# EAGLE design CARA_brain_v1_2 (EAGLE 7.3.0)

## Sheet 1 of 5
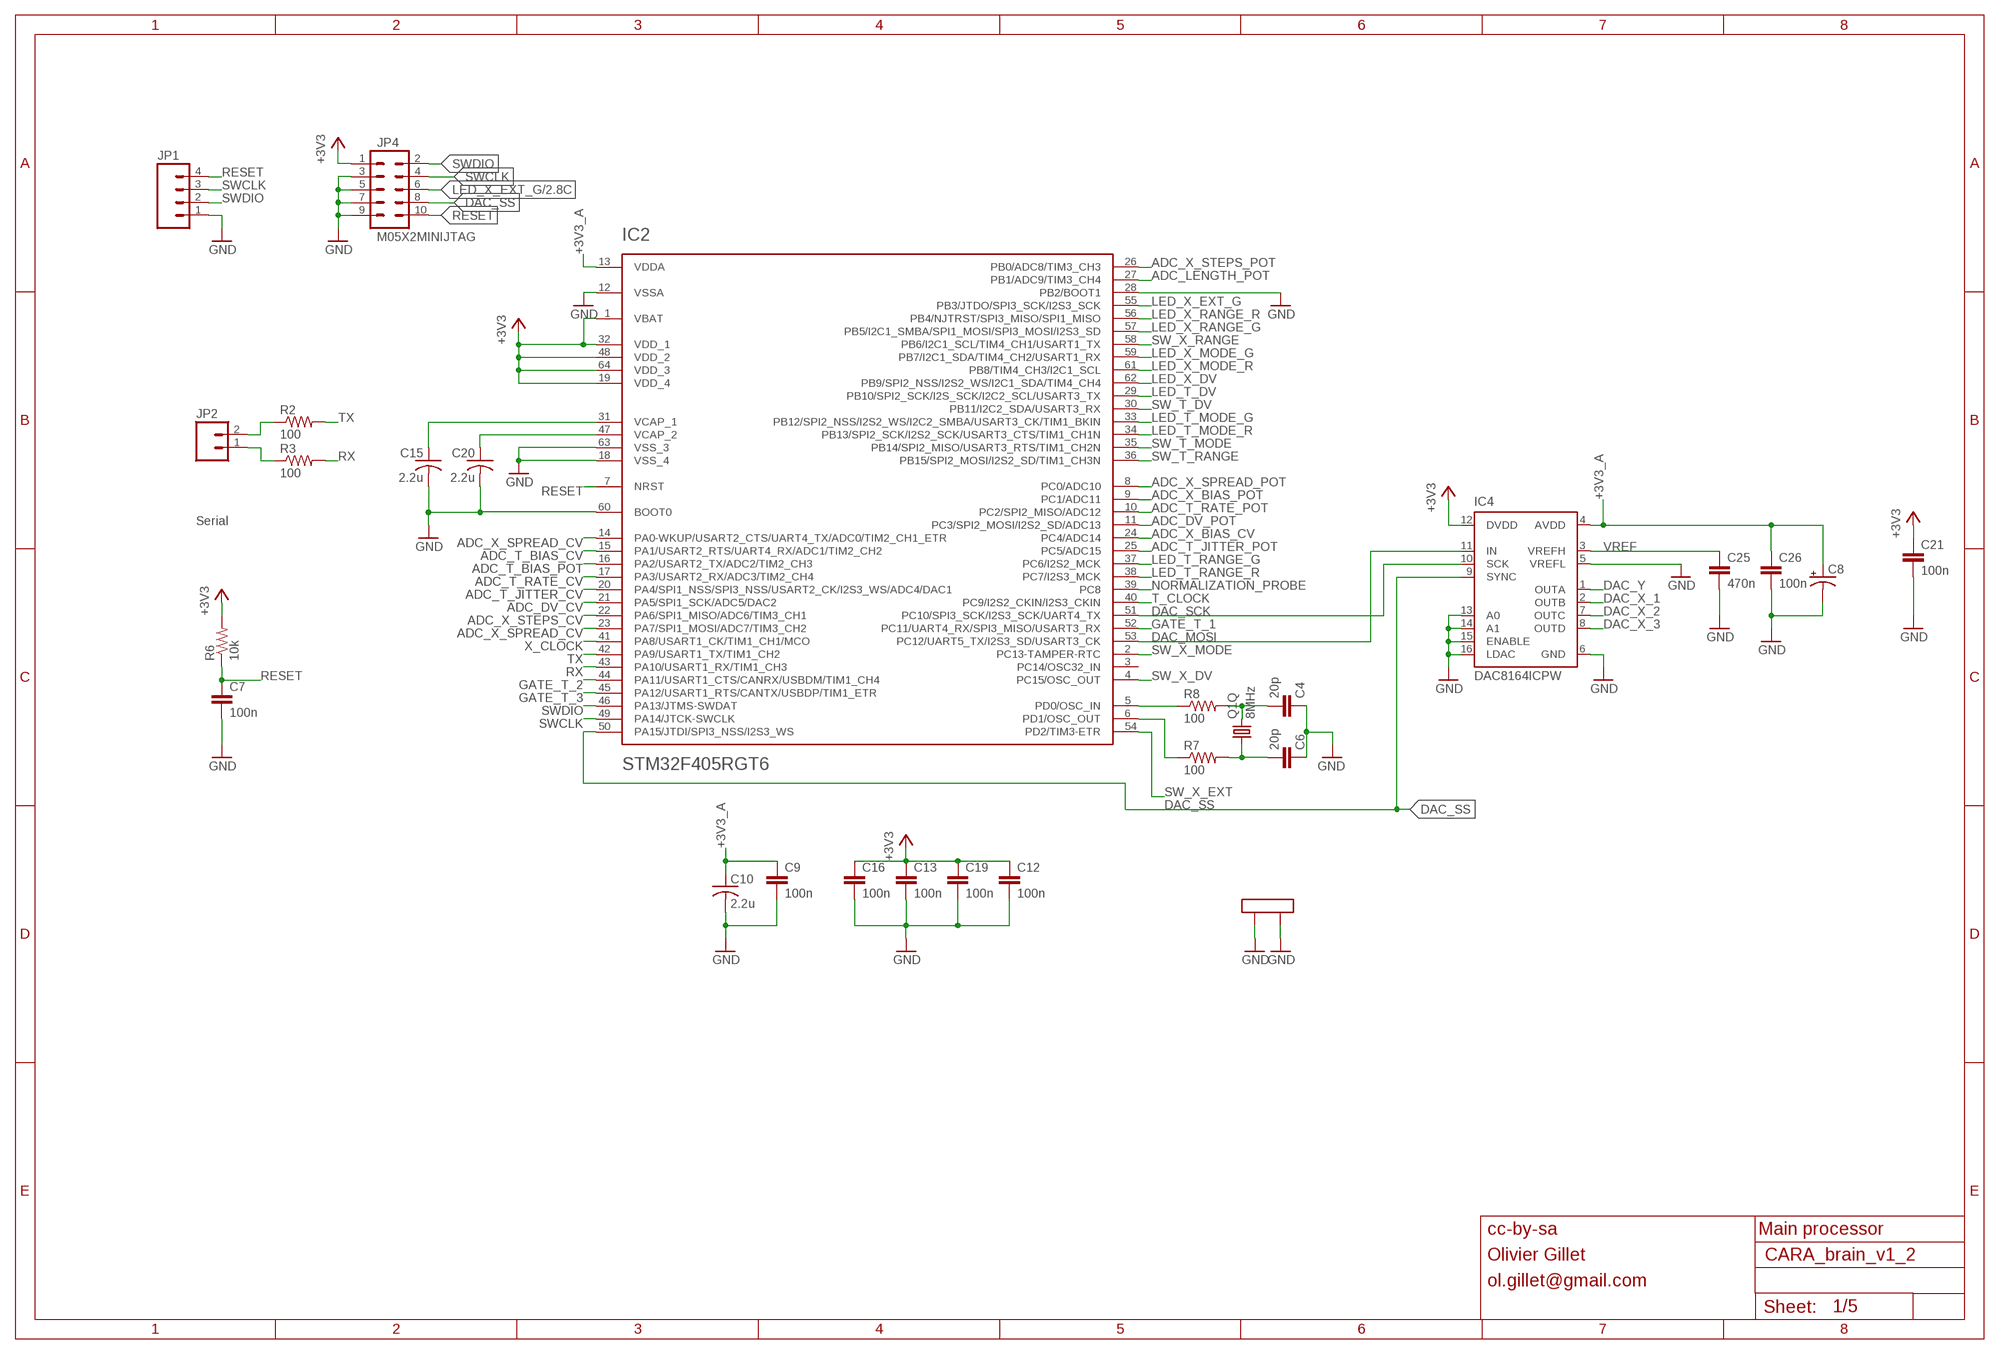
[diagram p0: schematic, sheet 1]

### Parts
C4  20p  CAPACITOR  [RESISTOR_0603]
C6  20p  CAPACITOR  [RESISTOR_0603]
C7  100n  CAPACITOR  [RESISTOR_0603]
C8  CAP_POLC  [PANASONIC_C]
C9  100n  CAPACITOR  [RESISTOR_0603]
C10  2.2u  C-USC0805  [C0805]
C12  100n  CAPACITOR  [RESISTOR_0603]
C13  100n  CAPACITOR  [RESISTOR_0603]
C15  2.2u  C-USC0805  [C0805]
C16  100n  CAPACITOR  [RESISTOR_0603]
C19  100n  CAPACITOR  [RESISTOR_0603]
C20  2.2u  C-USC0805  [C0805]
C21  100n  CAPACITOR  [RESISTOR_0603]
C25  470n  CAPACITOR  [RESISTOR_0603]
C26  100n  CAPACITOR  [RESISTOR_0603]
IC2  STM32F405RGT6  STM32F20X  [TQFP-10X10-64]
IC4  DAC8164ICPW  DAC8564  [SOP65P640X110-16N]
JP1  M04PTH  [1X04]
JP2  M02PTH  [1X02]
JP4  M05X2MINIJTAG  [2X5-1.27]
Q1  8MHz  CRYSTAL  [CTS406]
R2  100  RESISTOR  [RESISTOR_0603]
R3  100  RESISTOR  [RESISTOR_0603]
R6  10k  RESISTOR  [RESISTOR_0603]
R7  100  RESISTOR  [RESISTOR_0603]
R8  100  RESISTOR  [RESISTOR_0603]

### Nets
+3V3: C12.1 C13.1 C16.1 C19.1 C21.1 IC2.1(VBAT) IC2.19(VDD_4) IC2.32(VDD_1) IC2.48(VDD_2) IC2.64(VDD_3) IC4.12(DVDD) JP4.1 R6.2 ; also sheet 5
+3V3_A [wide]: C8.+ C9.1 C10.1 C26.1 IC2.13(VDDA) IC4.4(AVDD) ; also sheet 3,5
ADC_DV_CV: IC2.21(PA5/SPI1_SCK/ADC5/DAC2) ; also sheet 3
ADC_DV_POT: IC2.11(PC3/SPI2_MOSI/I2S2_SD/ADC13) ; also sheet 2
ADC_LENGTH_POT: IC2.27(PB1/ADC9/TIM3_CH4) ; also sheet 2
ADC_T_BIAS_CV: IC2.15(PA1/USART2_RTS/UART4_RX/ADC1/TIM2_CH2) ; also sheet 3
ADC_T_BIAS_POT: IC2.16(PA2/USART2_TX/ADC2/TIM2_CH3) ; also sheet 2
ADC_T_JITTER_CV: IC2.20(PA4/SPI1_NSS/SPI3_NSS/USART2_CK/I2S3_WS/ADC4/DAC1) ; also sheet 3
ADC_T_JITTER_POT: IC2.25(PC5/ADC15) ; also sheet 2
ADC_T_RATE_CV: IC2.17(PA3/USART2_RX/ADC3/TIM2_CH4) ; also sheet 3
ADC_T_RATE_POT: IC2.10(PC2/SPI2_MISO/ADC12) ; also sheet 2
ADC_X_BIAS_CV: IC2.24(PC4/ADC14) ; also sheet 3
ADC_X_BIAS_POT: IC2.9(PC1/ADC11) ; also sheet 2
ADC_X_SPREAD_CV: IC2.14(PA0-WKUP/USART2_CTS/UART4_TX/ADC0/TIM2_CH1_ETR) IC2.23(PA7/SPI1_MOSI/ADC7/TIM3_CH2) ; also sheet 3
ADC_X_SPREAD_POT: IC2.8(PC0/ADC10) ; also sheet 2
ADC_X_STEPS_CV: IC2.22(PA6/SPI1_MISO/ADC6/TIM3_CH1) ; also sheet 3
ADC_X_STEPS_POT: IC2.26(PB0/ADC8/TIM3_CH3) ; also sheet 2
DAC_MOSI: IC2.53(PC12/UART5_TX/I2S3_SD/USART3_CK) IC4.11(IN)
DAC_SCK: IC2.51(PC10/SPI3_SCK/I2S3_SCK/UART4_TX) IC4.10(SCK)
DAC_SS: IC2.50(PA15/JTDI/SPI3_NSS/I2S3_WS) IC4.9(SYNC) JP4.8
DAC_X_1: IC4.2(OUTB) ; also sheet 4
DAC_X_2: IC4.7(OUTC) ; also sheet 4
DAC_X_3: IC4.8(OUTD) ; also sheet 4
DAC_Y: IC4.1(OUTA) ; also sheet 4
GATE_T_1: IC2.52(PC11/UART4_RX/SPI3_MISO/USART3_RX) ; also sheet 4
GATE_T_2: IC2.44(PA11/USART1_CTS/CANRX/USBDM/TIM1_CH4) ; also sheet 4
GATE_T_3: IC2.45(PA12/USART1_RTS/CANTX/USBDP/TIM1_ETR) ; also sheet 4
GND: C4.1 C6.1 C7.2 C8.- C9.2 C10.2 C12.2 C13.2 C15.2 C16.2 C19.2 C20.2 C21.2 C25.2 C26.2 IC2.12(VSSA) IC2.18(VSS_4) IC2.28(PB2/BOOT1) IC2.60(BOOT0) IC2.63(VSS_3) IC4.5(VREFL) IC4.6(GND) IC4.13(A0) IC4.14(A1) IC4.15(ENABLE) IC4.16(LDAC) JP1.1 JP4.3 JP4.5 JP4.7 JP4.9 Q1.2(LID1) Q1.4(LID2) ; also sheet 3,5
LED_T_DV: IC2.29(PB10/SPI2_SCK/I2S_SCK/I2C2_SCL/USART3_TX) ; also sheet 2
LED_T_MODE_G: IC2.33(PB12/SPI2_NSS/I2S2_WS/I2C2_SMBA/USART3_CK/TIM1_BKIN) ; also sheet 2
LED_T_MODE_R: IC2.34(PB13/SPI2_SCK/I2S2_SCK/USART3_CTS/TIM1_CH1N) ; also sheet 2
LED_T_RANGE_G: IC2.37(PC6/I2S2_MCK) ; also sheet 2
LED_T_RANGE_R: IC2.38(PC7/I2S3_MCK) ; also sheet 2
LED_X_DV: IC2.62(PB9/SPI2_NSS/I2S2_WS/I2C1_SDA/TIM4_CH4) ; also sheet 2
LED_X_EXT_G: IC2.55(PB3/JTDO/SPI3_SCK/I2S3_SCK) JP4.6 ; also sheet 2
LED_X_MODE_G: IC2.59(PB7/I2C1_SDA/TIM4_CH2/USART1_RX) ; also sheet 2
LED_X_MODE_R: IC2.61(PB8/TIM4_CH3/I2C1_SCL) ; also sheet 2
LED_X_RANGE_G: IC2.57(PB5/I2C1_SMBA/SPI1_MOSI/SPI3_MOSI/I2S3_SD) ; also sheet 2
LED_X_RANGE_R: IC2.56(PB4/NJTRST/SPI3_MISO/SPI1_MISO) ; also sheet 2
N$7: IC2.6(PD1/OSC_OUT) R7.1
N$8: IC2.5(PD0/OSC_IN) R8.1
N$13: C20.1 IC2.47(VCAP_2)
N$19: C15.1 IC2.31(VCAP_1)
N$33: JP2.2 R2.1
N$51: JP2.1 R3.1
N$62: C4.2 Q1.3 R8.2
N$65: C6.2 Q1.1 R7.2
NORMALIZATION_PROBE: IC2.39(PC8) ; also sheet 3
RESET: C7.1 IC2.7(NRST) JP1.4 JP4.10 R6.1
RX: IC2.43(PA10/USART1_RX/TIM1_CH3) R3.2
SW_T_DV: IC2.30(PB11/I2C2_SDA/USART3_RX) ; also sheet 2
SW_T_MODE: IC2.35(PB14/SPI2_MISO/USART3_RTS/TIM1_CH2N) ; also sheet 2
SW_T_RANGE: IC2.36(PB15/SPI2_MOSI/I2S2_SD/TIM1_CH3N) ; also sheet 2
SW_X_DV: IC2.4(PC15/OSC_OUT) ; also sheet 2
SW_X_EXT: IC2.54(PD2/TIM3-ETR) ; also sheet 2
SW_X_MODE: IC2.2(PC13-TAMPER-RTC) ; also sheet 2
SW_X_RANGE: IC2.58(PB6/I2C1_SCL/TIM4_CH1/USART1_TX) ; also sheet 2
SWCLK: IC2.49(PA14/JTCK-SWCLK) JP1.3 JP4.4
SWDIO: IC2.46(PA13/JTMS-SWDAT) JP1.2 JP4.2
T_CLOCK: IC2.40(PC9/I2S2_CKIN/I2S3_CKIN) ; also sheet 3
TX: IC2.42(PA9/USART1_TX/TIM1_CH2) R2.2
VREF: C25.1 IC4.3(VREFH) ; also sheet 4
X_CLOCK: IC2.41(PA8/USART1_CK/TIM1_CH1/MCO) ; also sheet 3
Unconnected: IC2.3(PC14/OSC32_IN)

### Notes on the sheet
- Serial
- cc-by-sa | Main processor
- Olivier Gillet
- ol.gillet@gmail.com

## Sheet 2 of 5
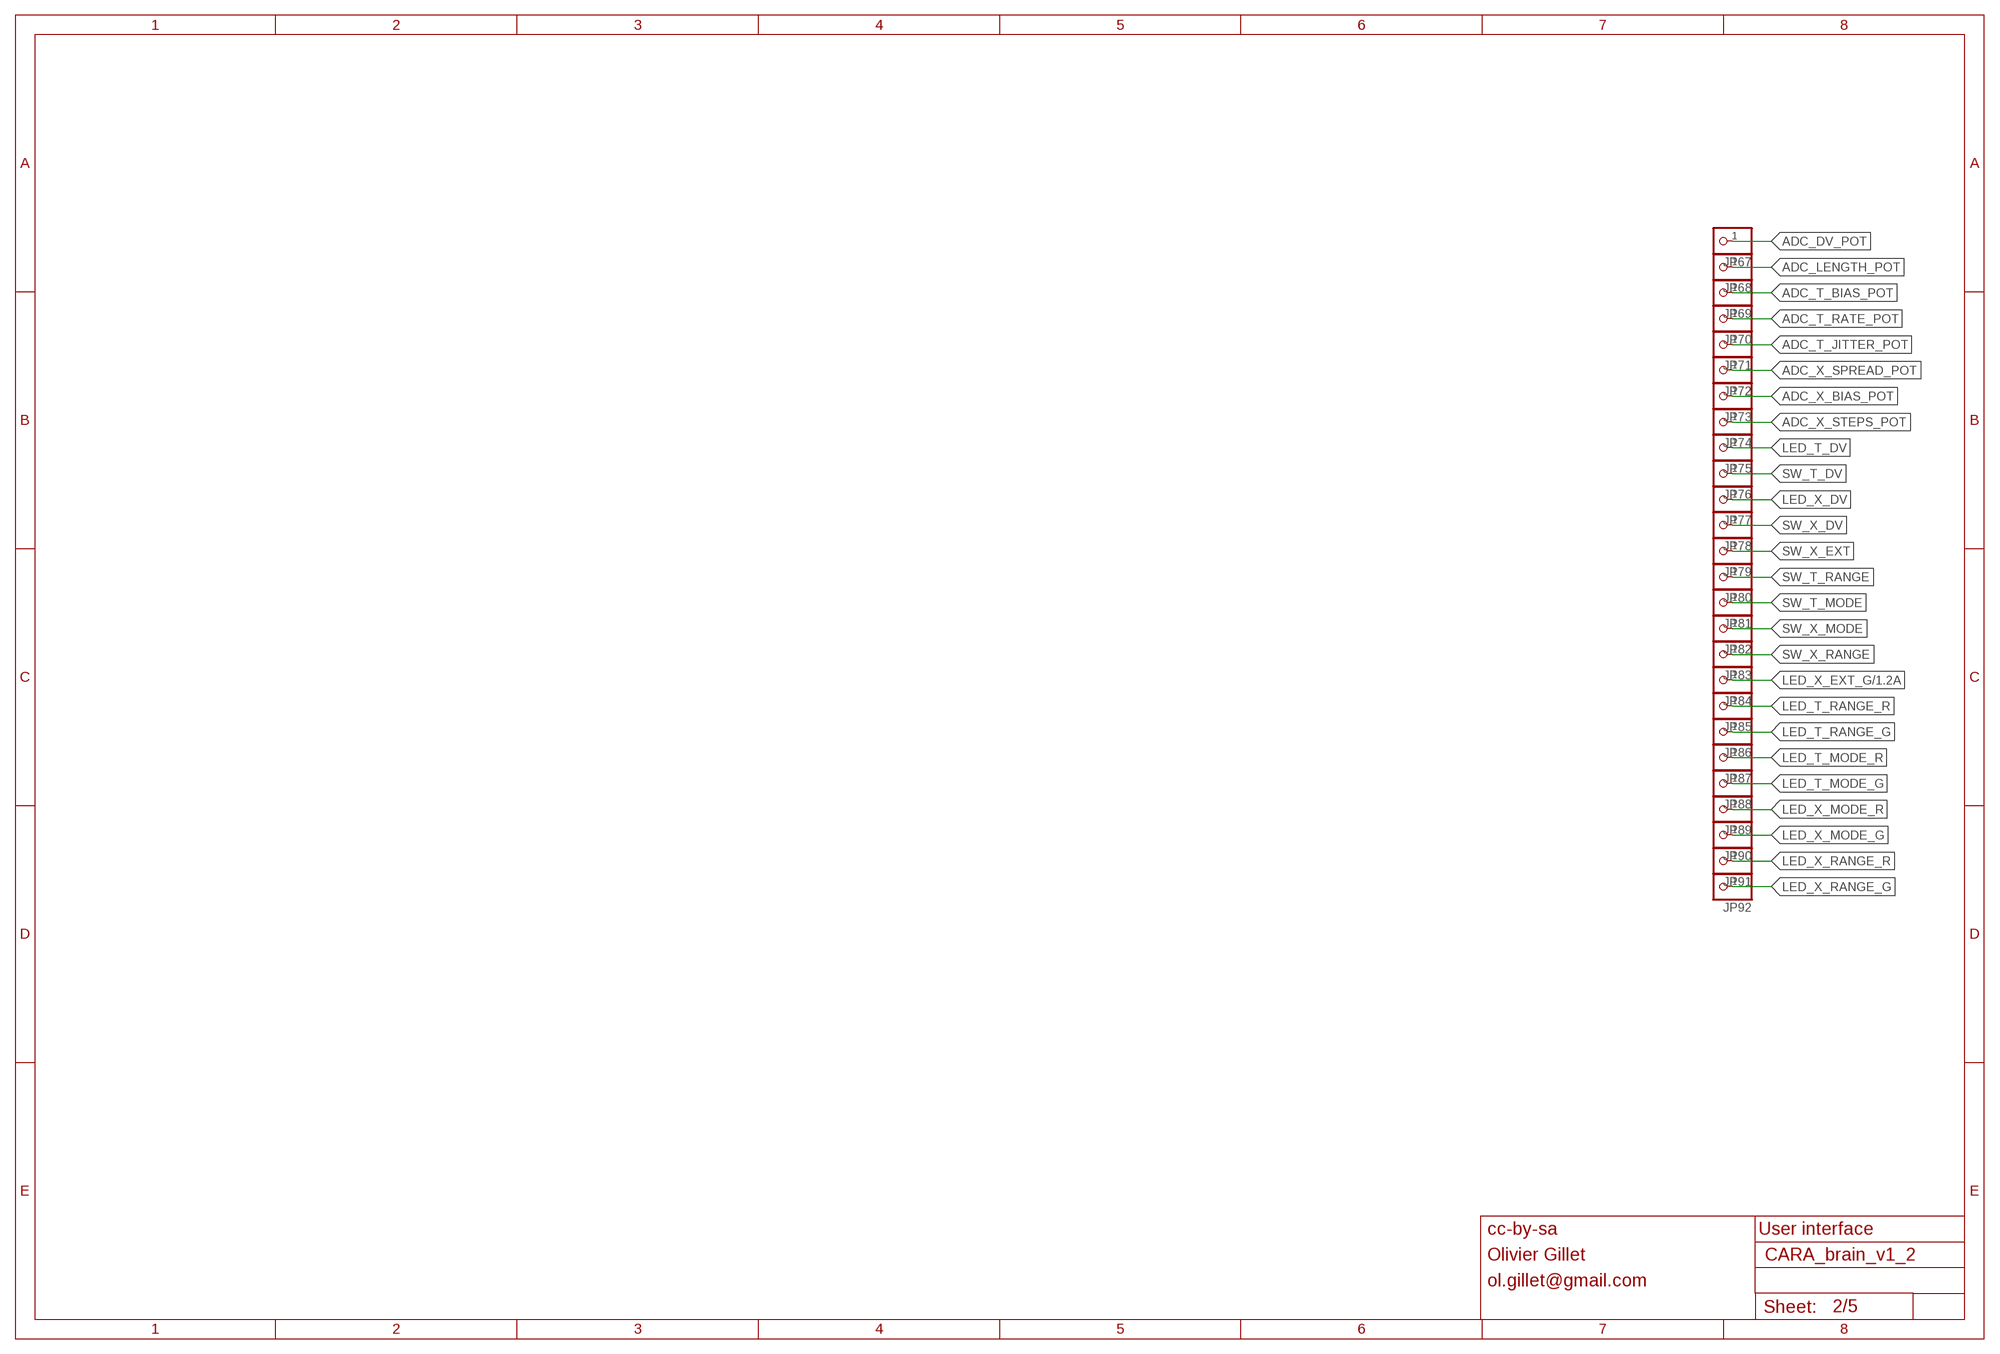
[diagram p1: schematic, sheet 2]

### Parts
JP67  PINHD-1X1  [1X01]
JP68  PINHD-1X1  [1X01]
JP69  PINHD-1X1  [1X01]
JP70  PINHD-1X1  [1X01]
JP71  PINHD-1X1  [1X01]
JP72  PINHD-1X1  [1X01]
JP73  PINHD-1X1  [1X01]
JP74  PINHD-1X1  [1X01]
JP75  PINHD-1X1  [1X01]
JP76  PINHD-1X1  [1X01]
JP77  PINHD-1X1  [1X01]
JP78  PINHD-1X1  [1X01]
JP79  PINHD-1X1  [1X01]
JP80  PINHD-1X1  [1X01]
JP81  PINHD-1X1  [1X01]
JP82  PINHD-1X1  [1X01]
JP83  PINHD-1X1  [1X01]
JP84  PINHD-1X1  [1X01]
JP85  PINHD-1X1  [1X01]
JP86  PINHD-1X1  [1X01]
JP87  PINHD-1X1  [1X01]
JP88  PINHD-1X1  [1X01]
JP89  PINHD-1X1  [1X01]
JP90  PINHD-1X1  [1X01]
JP91  PINHD-1X1  [1X01]
JP92  PINHD-1X1  [1X01]

### Nets
ADC_DV_POT: JP67.1 ; also sheet 1
ADC_LENGTH_POT: JP68.1 ; also sheet 1
ADC_T_BIAS_POT: JP69.1 ; also sheet 1
ADC_T_JITTER_POT: JP71.1 ; also sheet 1
ADC_T_RATE_POT: JP70.1 ; also sheet 1
ADC_X_BIAS_POT: JP73.1 ; also sheet 1
ADC_X_SPREAD_POT: JP72.1 ; also sheet 1
ADC_X_STEPS_POT: JP74.1 ; also sheet 1
LED_T_DV: JP75.1 ; also sheet 1
LED_T_MODE_G: JP88.1 ; also sheet 1
LED_T_MODE_R: JP87.1 ; also sheet 1
LED_T_RANGE_G: JP86.1 ; also sheet 1
LED_T_RANGE_R: JP85.1 ; also sheet 1
LED_X_DV: JP77.1 ; also sheet 1
LED_X_EXT_G: JP84.1 ; also sheet 1
LED_X_MODE_G: JP90.1 ; also sheet 1
LED_X_MODE_R: JP89.1 ; also sheet 1
LED_X_RANGE_G: JP92.1 ; also sheet 1
LED_X_RANGE_R: JP91.1 ; also sheet 1
SW_T_DV: JP76.1 ; also sheet 1
SW_T_MODE: JP81.1 ; also sheet 1
SW_T_RANGE: JP80.1 ; also sheet 1
SW_X_DV: JP78.1 ; also sheet 1
SW_X_EXT: JP79.1 ; also sheet 1
SW_X_MODE: JP82.1 ; also sheet 1
SW_X_RANGE: JP83.1 ; also sheet 1

### Notes on the sheet
- cc-by-sa | User interface
- Olivier Gillet
- ol.gillet@gmail.com

## Sheet 3 of 5
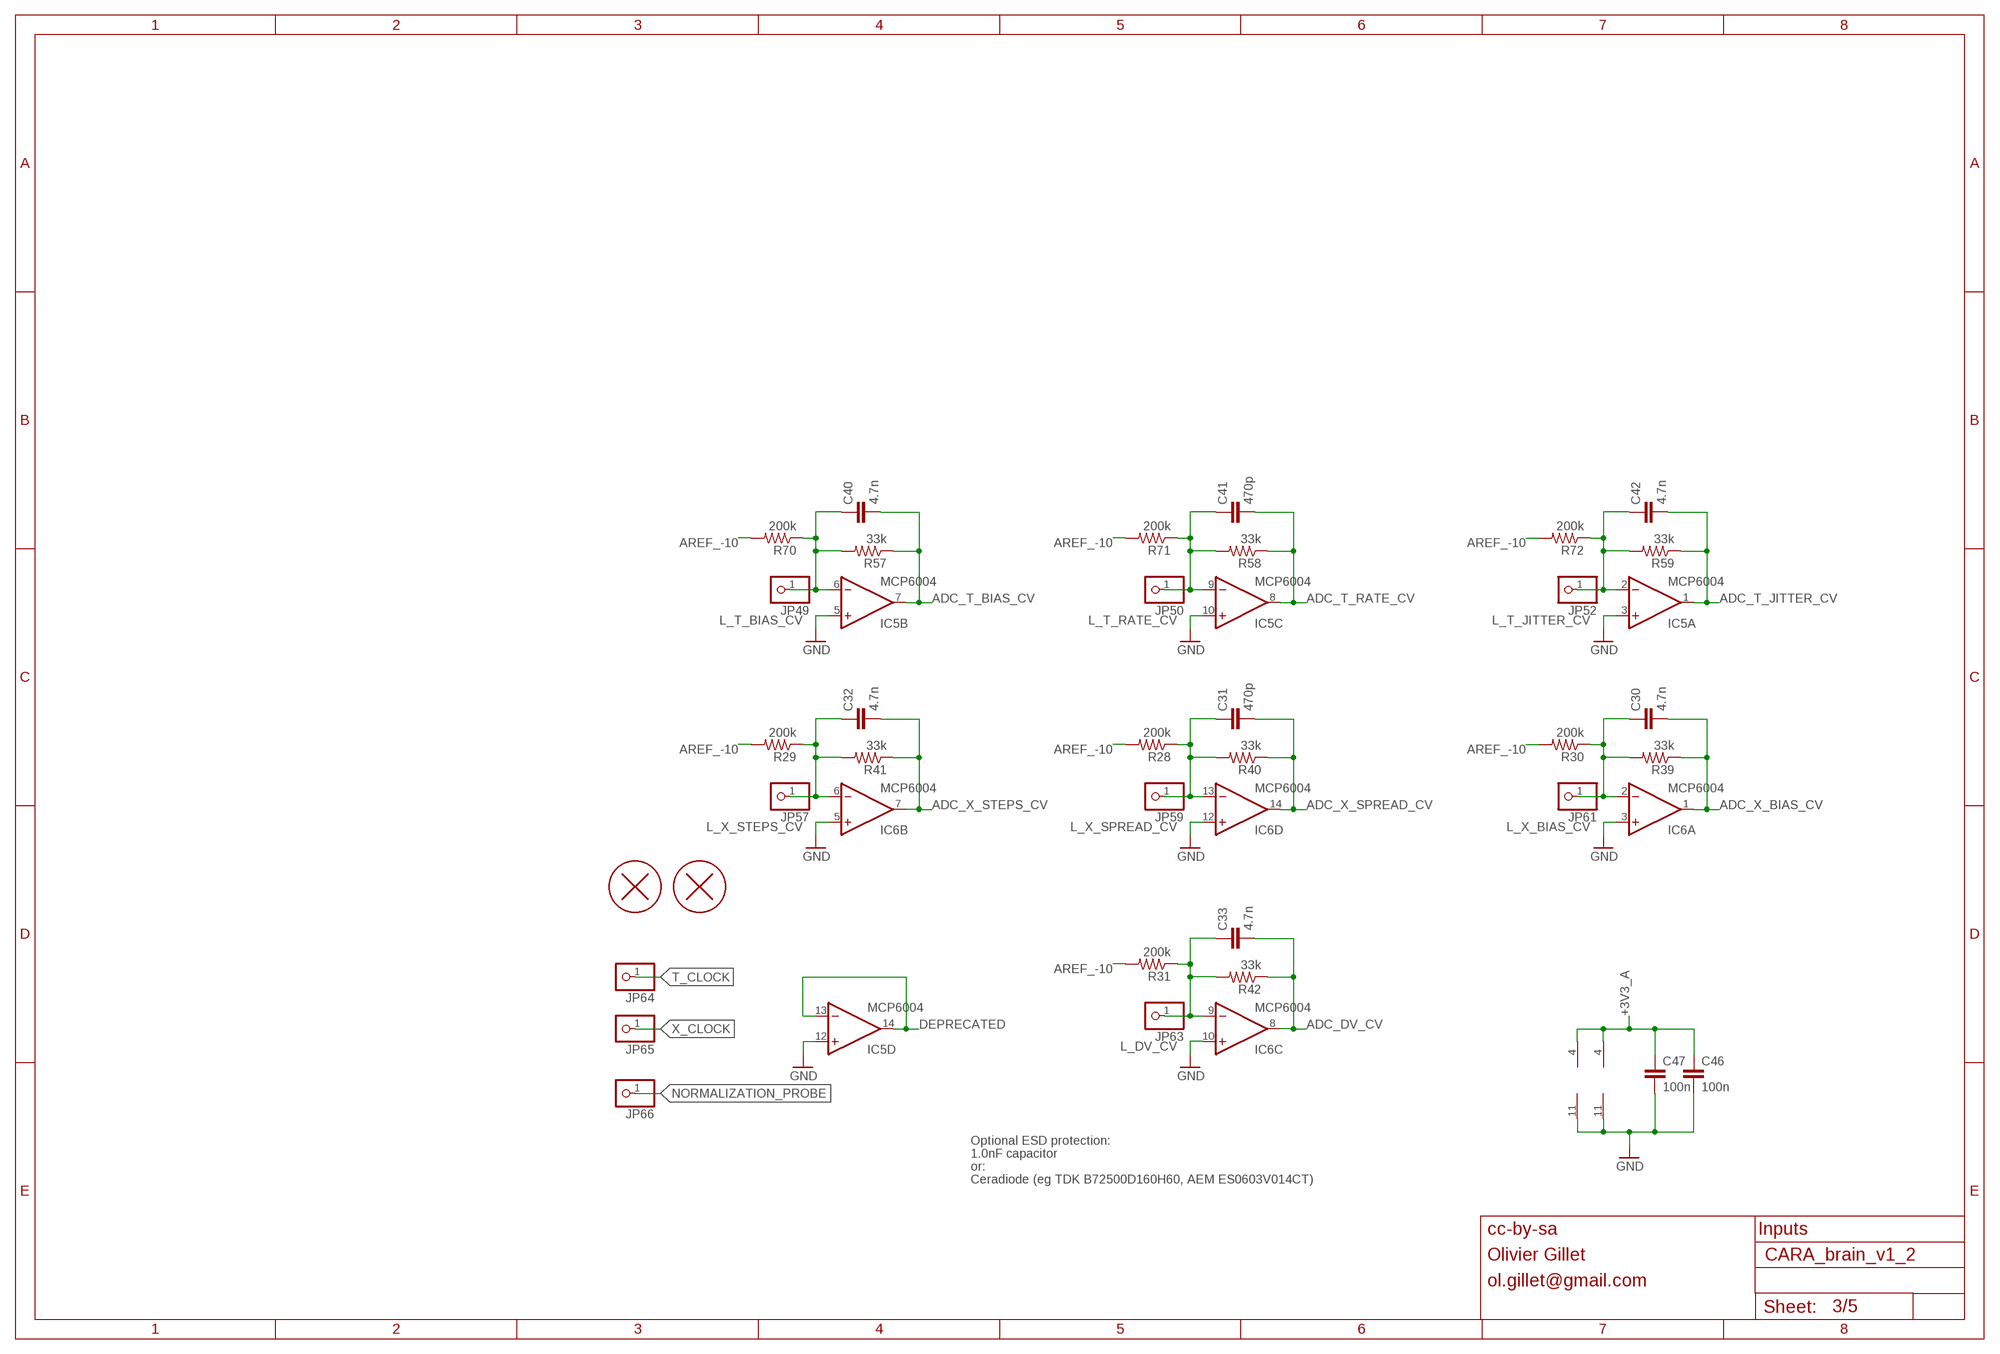
[diagram p2: schematic, sheet 3]

### Parts
C30  4.7n  CAPACITOR  [RESISTOR_0603]
C31  470p  CAPACITOR  [RESISTOR_0603]
C32  4.7n  CAPACITOR  [RESISTOR_0603]
C33  4.7n  CAPACITOR  [RESISTOR_0603]
C40  4.7n  CAPACITOR  [RESISTOR_0603]
C41  470p  CAPACITOR  [RESISTOR_0603]
C42  4.7n  CAPACITOR  [RESISTOR_0603]
C46  100n  CAPACITOR  [RESISTOR_0603]
C47  100n  CAPACITOR  [RESISTOR_0603]
H1  PCB_SCREW  [PCB_SCREW]
H2  PCB_SCREW  [PCB_SCREW]
IC5  MCP6004  TL074PW  [TSSOP14_065]
IC6  MCP6004  TL074PW  [TSSOP14_065]
JP49  PINHD-1X1  [1X01]
JP50  PINHD-1X1  [1X01]
JP52  PINHD-1X1  [1X01]
JP57  PINHD-1X1  [1X01]
JP59  PINHD-1X1  [1X01]
JP61  PINHD-1X1  [1X01]
JP63  PINHD-1X1  [1X01]
JP64  PINHD-1X1  [1X01]
JP65  PINHD-1X1  [1X01]
JP66  PINHD-1X1  [1X01]
R28  200k  RESISTOR  [RESISTOR_0603]
R29  200k  RESISTOR  [RESISTOR_0603]
R30  200k  RESISTOR  [RESISTOR_0603]
R31  200k  RESISTOR  [RESISTOR_0603]
R39  33k  RESISTOR  [RESISTOR_0603]
R40  33k  RESISTOR  [RESISTOR_0603]
R41  33k  RESISTOR  [RESISTOR_0603]
R42  33k  RESISTOR  [RESISTOR_0603]
R57  33k  RESISTOR  [RESISTOR_0603]
R58  33k  RESISTOR  [RESISTOR_0603]
R59  33k  RESISTOR  [RESISTOR_0603]
R70  200k  RESISTOR  [RESISTOR_0603]
R71  200k  RESISTOR  [RESISTOR_0603]
R72  200k  RESISTOR  [RESISTOR_0603]

### Nets
+3V3_A [wide]: C46.1 C47.1 IC5.4(P:V+) IC6.4(P:V+) ; also sheet 1,5
ADC_DV_CV: C33.2 IC6.8(C:OUT) R42.1 ; also sheet 1
ADC_T_BIAS_CV: C40.2 IC5.7(B:OUT) R57.1 ; also sheet 1
ADC_T_JITTER_CV: C42.2 IC5.1(A:OUT) R59.1 ; also sheet 1
ADC_T_RATE_CV: C41.2 IC5.8(C:OUT) R58.1 ; also sheet 1
ADC_X_BIAS_CV: C30.2 IC6.1(A:OUT) R39.1 ; also sheet 1
ADC_X_SPREAD_CV: C31.2 IC6.14(D:OUT) R40.1 ; also sheet 1
ADC_X_STEPS_CV: C32.2 IC6.7(B:OUT) R41.1 ; also sheet 1
AREF_-10 [wide]: R28.2 R29.2 R30.2 R31.2 R70.2 R71.2 R72.2 ; also sheet 5
DEPRECATED: IC5.13(D:-IN) IC5.14(D:OUT)
GND: C46.2 C47.2 IC5.3(A:+IN) IC5.5(B:+IN) IC5.10(C:+IN) IC5.11(P:V-) IC5.12(D:+IN) IC6.3(A:+IN) IC6.5(B:+IN) IC6.10(C:+IN) IC6.11(P:V-) IC6.12(D:+IN) ; also sheet 1,5
L_DV_CV: C33.1 IC6.9(C:-IN) JP63.1 R31.1 R42.2
L_T_BIAS_CV: C40.1 IC5.6(B:-IN) JP49.1 R57.2 R70.1
L_T_JITTER_CV: C42.1 IC5.2(A:-IN) JP52.1 R59.2 R72.1
L_T_RATE_CV: C41.1 IC5.9(C:-IN) JP50.1 R58.2 R71.1
L_X_BIAS_CV: C30.1 IC6.2(A:-IN) JP61.1 R30.1 R39.2
L_X_SPREAD_CV: C31.1 IC6.13(D:-IN) JP59.1 R28.1 R40.2
L_X_STEPS_CV: C32.1 IC6.6(B:-IN) JP57.1 R29.1 R41.2
NORMALIZATION_PROBE: JP66.1 ; also sheet 1
T_CLOCK: JP64.1 ; also sheet 1
X_CLOCK: JP65.1 ; also sheet 1

### Notes on the sheet
- Optional ESD protection:
- 1.0nF capacitor
- or:
- Ceradiode (eg TDK B72500D160H60, AEM ES0603V014CT)
- cc-by-sa | Inputs
- Olivier Gillet
- ol.gillet@gmail.com

## Sheet 4 of 5
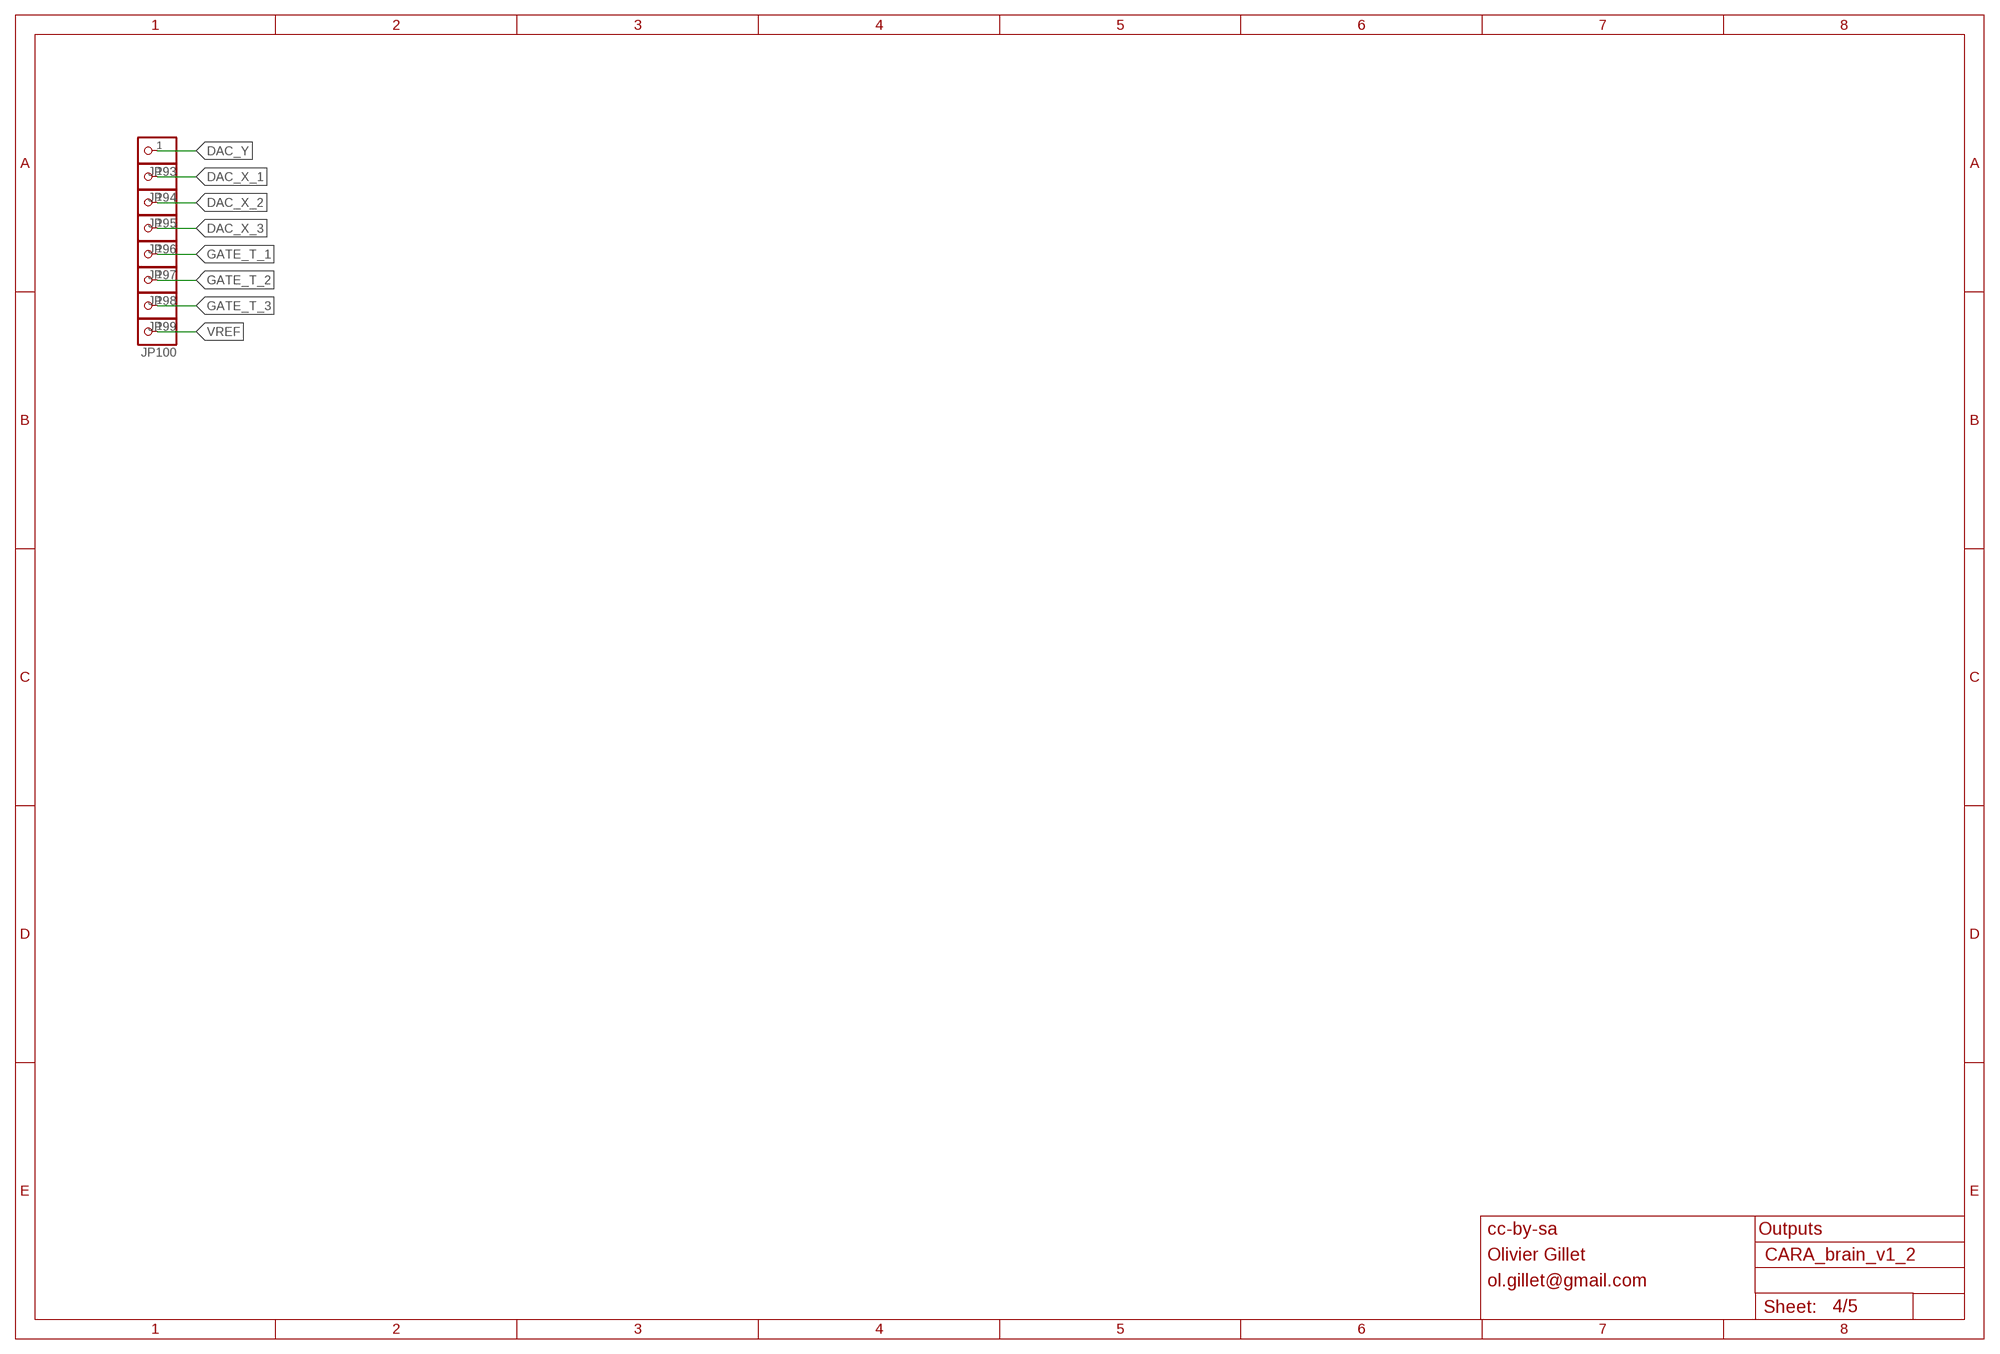
[diagram p3: schematic, sheet 4]

### Parts
JP93  PINHD-1X1  [1X01]
JP94  PINHD-1X1  [1X01]
JP95  PINHD-1X1  [1X01]
JP96  PINHD-1X1  [1X01]
JP97  PINHD-1X1  [1X01]
JP98  PINHD-1X1  [1X01]
JP99  PINHD-1X1  [1X01]
JP100  PINHD-1X1  [1X01]

### Nets
DAC_X_1: JP94.1 ; also sheet 1
DAC_X_2: JP95.1 ; also sheet 1
DAC_X_3: JP96.1 ; also sheet 1
DAC_Y: JP93.1 ; also sheet 1
GATE_T_1: JP97.1 ; also sheet 1
GATE_T_2: JP98.1 ; also sheet 1
GATE_T_3: JP99.1 ; also sheet 1
VREF: JP100.1 ; also sheet 1

### Notes on the sheet
- cc-by-sa | Outputs
- Olivier Gillet
- ol.gillet@gmail.com

## Sheet 5 of 5
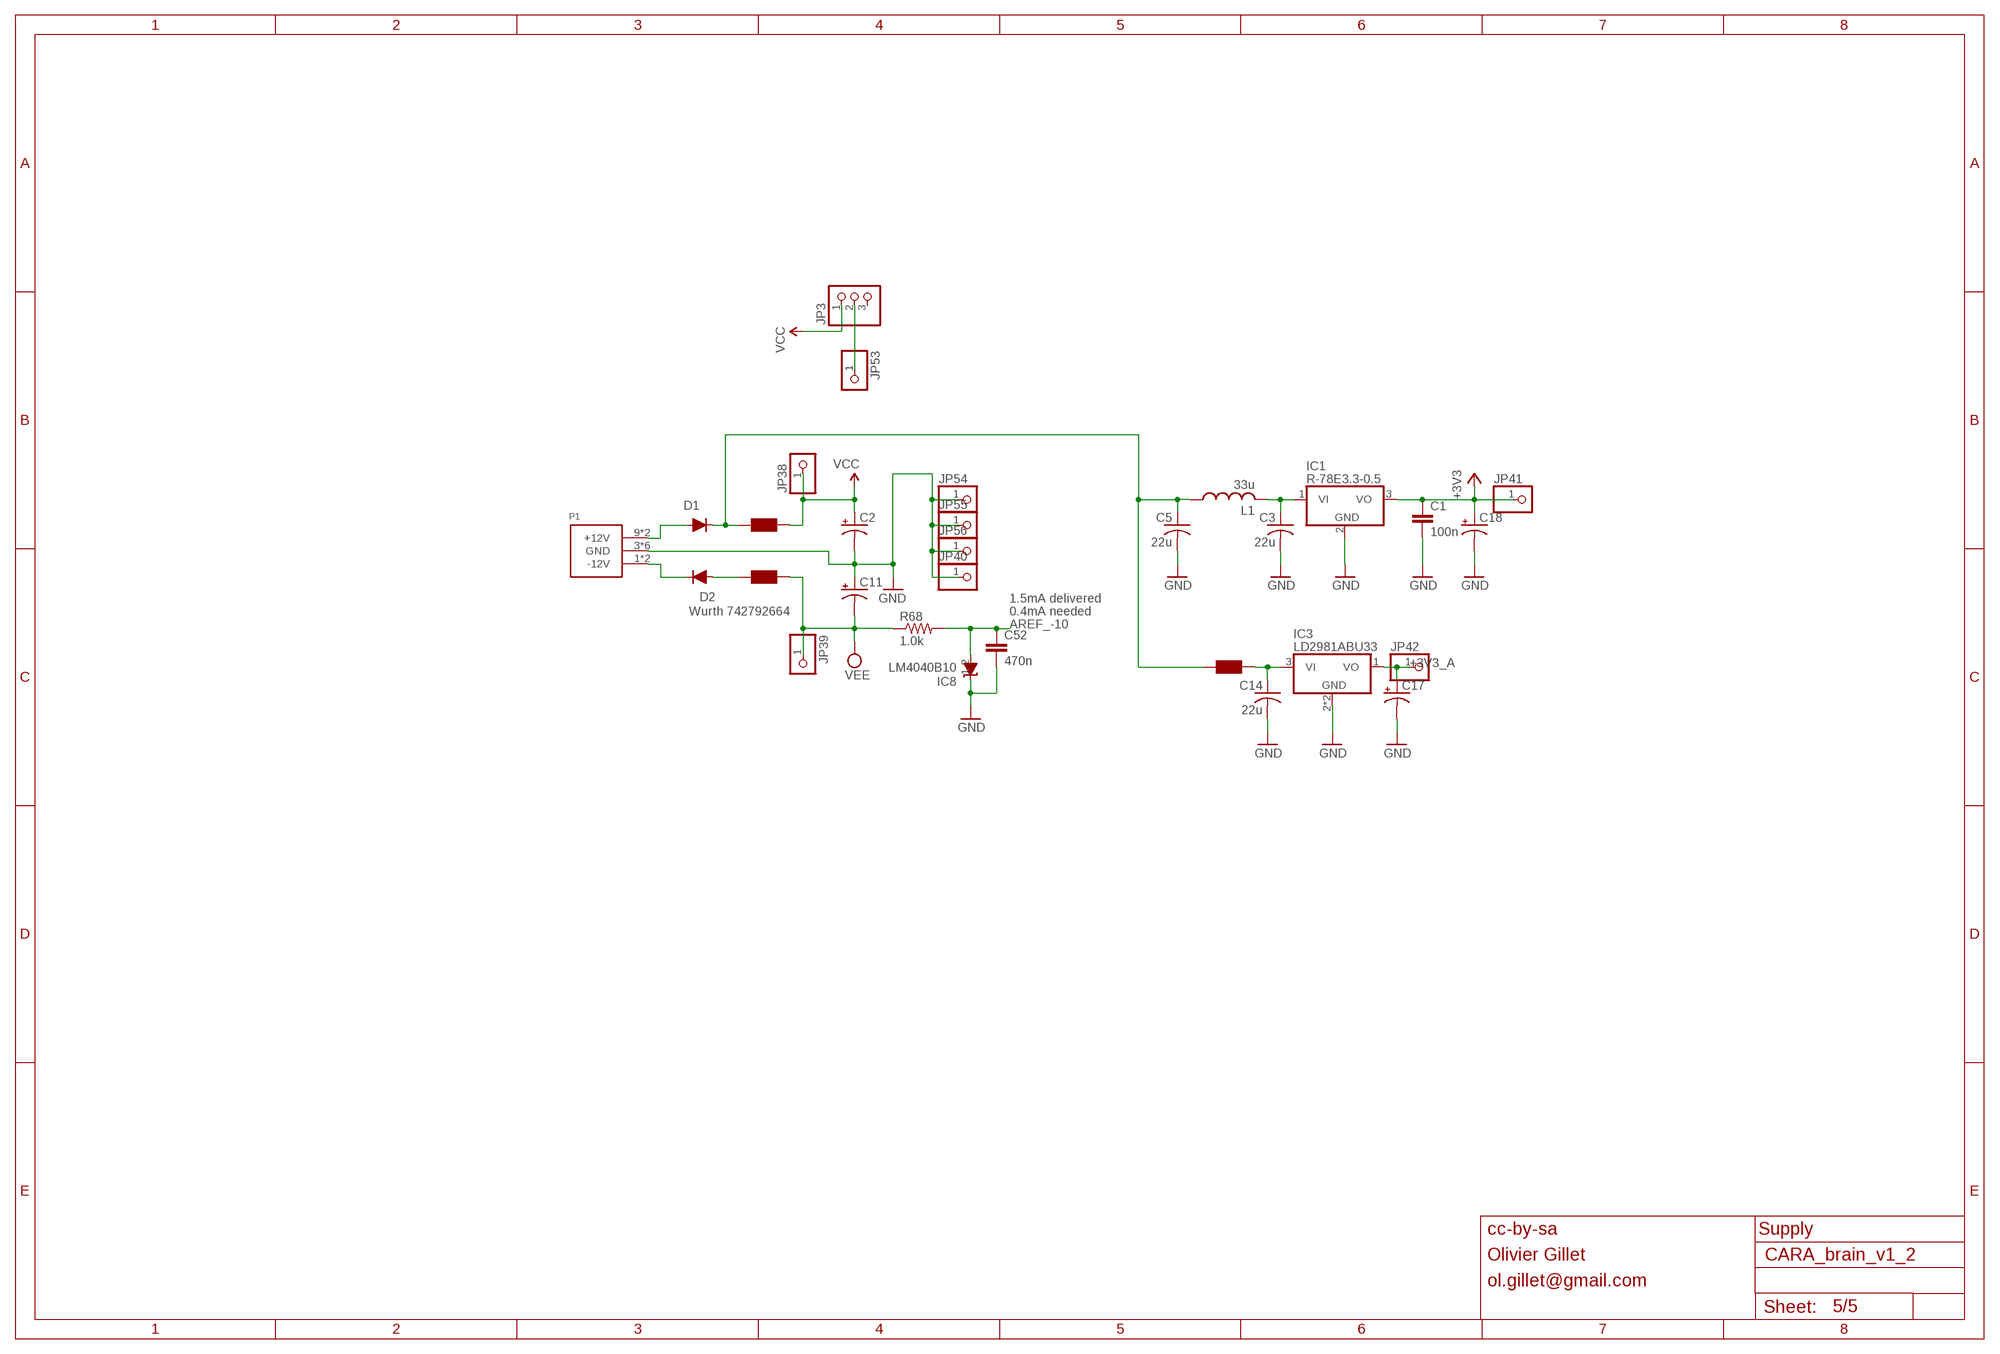
[diagram p4: schematic, sheet 5]

### Parts
C1  100n  CAPACITOR  [RESISTOR_0603]
C2  CAP_POLC  [PANASONIC_C]
C3  22u  C-USC1206  [C1206]
C5  22u  C-USC1206  [C1206]
C11  CAP_POLC  [PANASONIC_C]
C14  22u  C-USC1206  [C1206]
C17  CAP_POLC  [PANASONIC_C]
C18  CAP_POLC  [PANASONIC_C]
C52  470n  CAPACITOR  [RESISTOR_0603]
D1  1N5819HW  DIODE  [SOD123]
D2  1N5819HW  DIODE  [SOD123]
F1  FERRITE-BEAD  [RESISTOR_0603]
F2  FERRITE-BEAD  [RESISTOR_0603]
F3  FERRITE-BEAD  [RESISTOR_0603]
IC1  R-78E3.3-0.5  WE173950378  [WE78]
IC3  LD2981ABU33  LD2981  [SOT89]
IC8  LM4040B10  LM4040SOT23  [SOT23]
JP3  PINHD-1X3  [1X03]
JP38  PINHD-1X1  [1X01]
JP39  PINHD-1X1  [1X01]
JP40  PINHD-1X1  [1X01]
JP41  PINHD-1X1  [1X01]
JP42  PINHD-1X1  [1X01]
JP53  PINHD-1X1  [1X01]
JP54  PINHD-1X1  [1X01]
JP55  PINHD-1X1  [1X01]
JP56  PINHD-1X1  [1X01]
L1  33u  L-USL2012C  [L2012C]
P1  POWER_SIMPLE10  [POWER_10]
R68  1.0k  RESISTOR  [RESISTOR_0603]

### Nets
+3V3: C1.1 C18.+ IC1.3(VO) JP41.1 ; also sheet 1
+3V3_A [wide]: C17.+ IC3.1(VO) JP42.1 ; also sheet 1,3
AREF_-10 [wide]: C52.1 IC8.2(A) R68.2 ; also sheet 3
GND: C1.2 C2.- C3.2 C5.2 C11.+ C14.2 C17.- C18.- C52.2 IC1.2(GND) IC3.2(GND) IC3.2@1(GND) IC8.1(C) JP40.1 JP54.1 JP55.1 JP56.1 P1.3(GND) P1.4(GND) P1.5(GND) P1.6(GND) P1.7(GND) P1.8(GND) ; also sheet 1,3
N$1 [wide]: D1.+ P1.9(+12V) P1.10(+12V)
N$2 [wide]: D2.- P1.1(-12V) P1.2(-12V)
N$3 [wide]: JP3.2 JP53.1
N$4 [wide]: C14.1 F3.1 IC3.3(VI)
N$6 [wide]: C5.1 D1.- F1.2 F3.2 L1.1
N$10 [wide]: D2.+ F2.2
N$32 [wide]: C3.1 IC1.1(VI) L1.2
VCC [wide]: C2.+ F1.1 JP3.1 JP38.1
VEE [wide]: C11.- F2.1 JP39.1 R68.1
Unconnected: JP3.3

### Notes on the sheet
- 1.5mA delivered
- Wurth 742792664 | 0.4mA needed
- cc-by-sa | Supply
- Olivier Gillet
- ol.gillet@gmail.com

## Library data of the parts
C1 C4 C6 C7 C9 C12 C13 C16 C19 C21 C25 C26 C30-C33 C40-C42 C46 C47 C52 = parts_aman:CAPACITOR
C2 C8 C11 C17 C18 = parts_aman:CAP_POL
C3 C5 C10 C14 C15 C20 = rcl:C-US: CAPACITOR, American symbol
D1 D2 = parts_aman:DIODE
F1-F3 = parts_aman:FERRITE-BEAD
H1 H2 = parts_aman:PCB_SCREW
IC1 = parts_aman:WE173950378
IC2 = og-stm32f2:STM32F20X
IC3 = parts_aman:LD2981
IC4 = og-dac:DAC8564
IC5 IC6 = og-linear:TL074: OP AMP
IC8 = parts_aman:LM4040
JP1 = SparkFun:M04: Header 4 Standard 4-pin 0.1" header. Use with straight break away headers (SKU : PRT-00116), right angle break away headers (PRT-00553), swiss pins (PRT-00743), machine pins (PRT-00117), and female headers (PRT-00115). Molex polarized connector foot print use with SKU : PRT-08231 with associated crimp pins and housings.
JP2 = SparkFun:M02: Header 2 Standard 2-pin 0.1" header. Use with straight break away headers (SKU : PRT-00116), right angle break away headers (PRT-00553), swiss pins (PRT-00743), machine pins (PRT-00117), and female headers (PRT-00115). Molex polarized connector foot print use with SKU : PRT-08233 with associated crimp pins and housings.
JP3 = parts_aman:PINHD-1X3: PIN HEADER
JP4 = parts_aman:M05X2: Header 5x2 Standard 10-pin dual row 0.1" header. Commonly used with AVR-ISP. Use with Spark Fun Electronics SKU: PRT-00778
JP38-JP42 JP49 JP50 JP52-JP57 JP59 JP61 JP63-JP100 = parts_aman:PINHD-1X1: PIN HEADER
L1 = og-rcl:L-US
P1 = parts_aman:POWER_SIMPLE
Q1 = og-crystal:CRYSTAL: Crystal with 2 extra terminals for the metal LID (Abracon ABMM2 for example)
R2 R3 R6-R8 R28-R31 R39-R42 R57-R59 R68 R70-R72 = parts_aman:RESISTOR

## Net classes
0 default: width 0.152 mm, drill 0.305 mm, clearance 0.152 mm
1 mid: width 0.254 mm, drill 0.305 mm, clearance 0.152 mm
2 wide: width 0.305 mm, drill 0.305 mm, clearance 0.152 mm

## Board
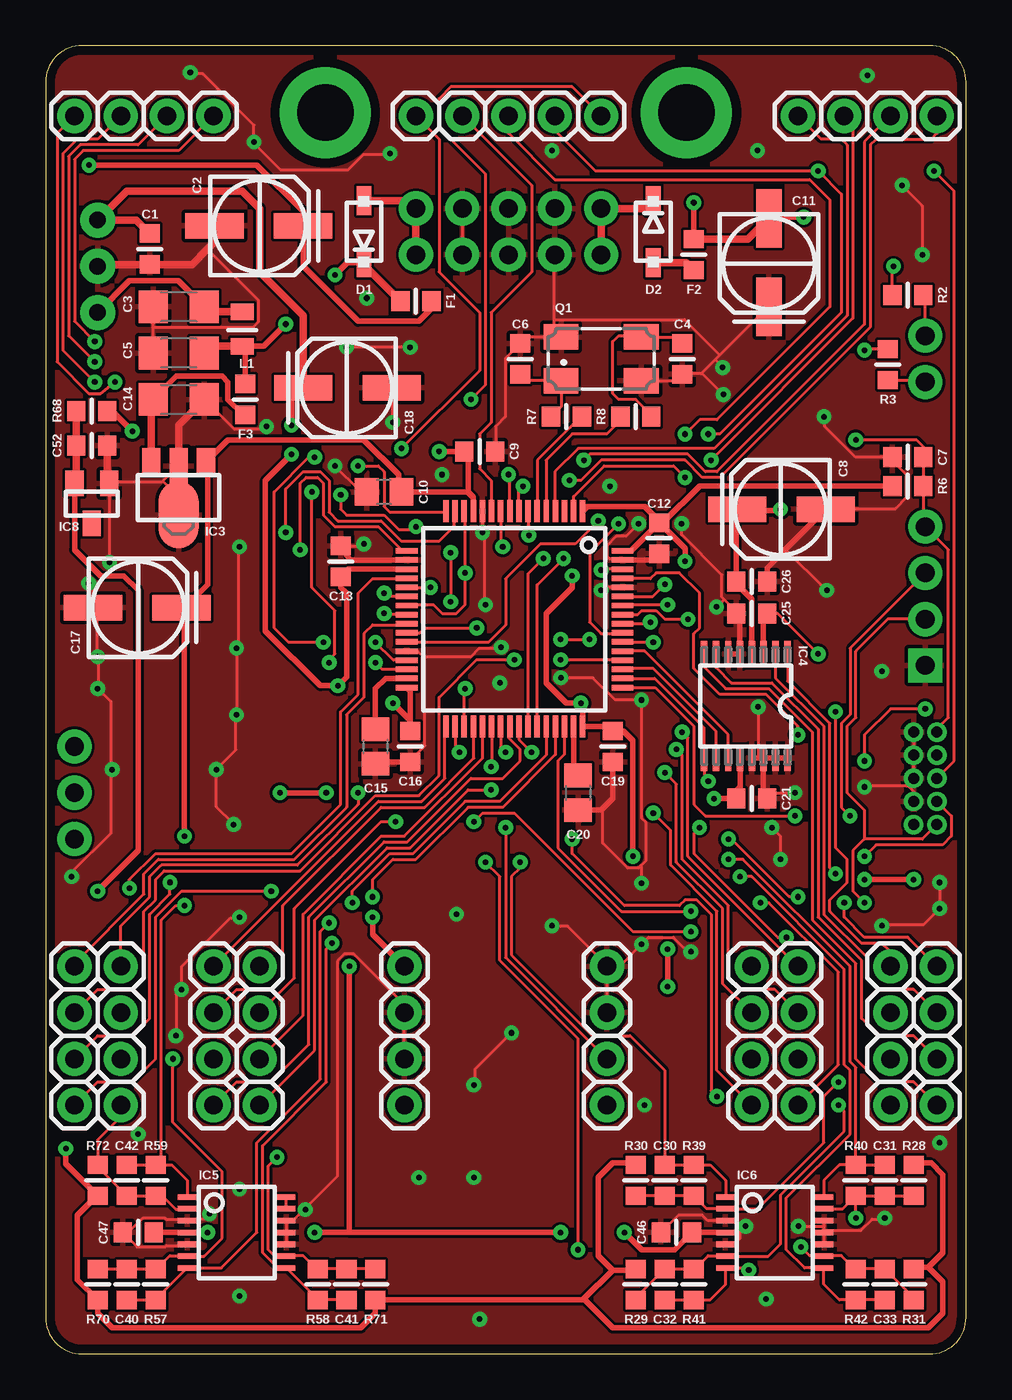
[diagram p5: board, top side]
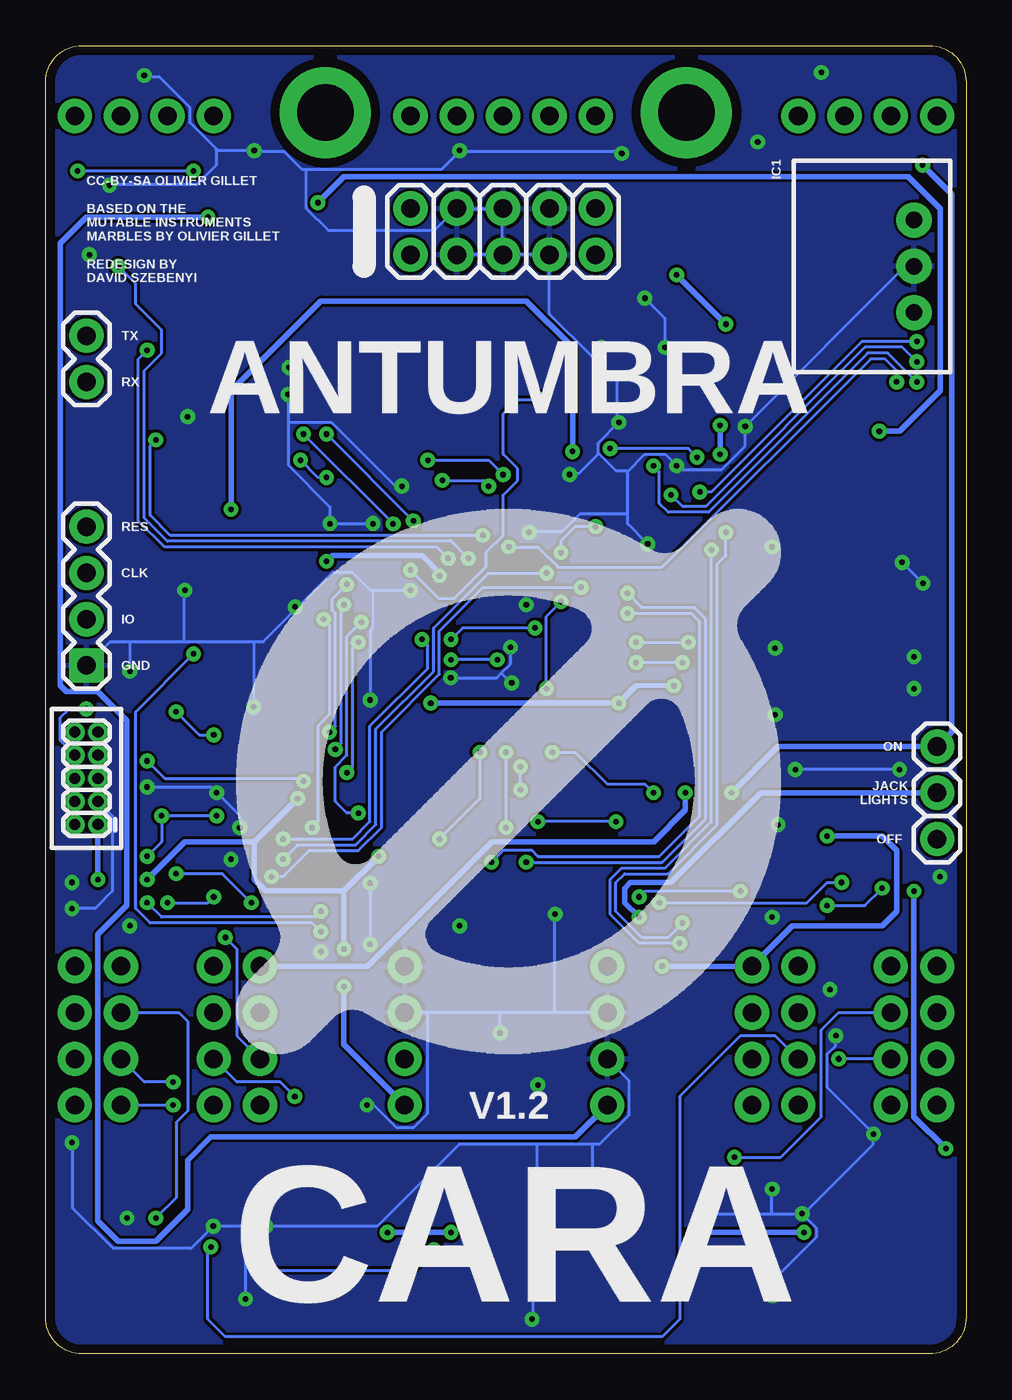
[diagram p6: board, bottom side, seen from below]

Size 50.5 x 71.81 mm. Coordinates in mm from the lower left corner, seen from the top.
Outline: 2,0 48.5,0 arc90 50.5,2 50.5,69.81 arc90 48.5,71.81 2,71.81 arc90 0,69.81 0,2 arc90 2,0
Copper layers (1*16): Top 0.035mm / dielectric 1.5mm / Bottom 0.035mm
Design rules "PCBCart-Standard": minimum track width 6mil, minimum drill 12mil, track to track 6mil, track to pad 6mil, pad to pad 6mil, via to via 6mil, smd to smd 6mil, copper to edge 20mil, drill to drill 8mil, minimum pad ring 8mil, minimum via ring 10mil, stop-mask expansion 3mil, vias tented up to drill 25mil, thermal gap 8mil

### Footprints (pad centres in the part's own frame; a part is rotated, then mirrored left to right if it is on the bottom)
RESISTOR_0603 = smd 1 x 1.1: 1 -0.85,0; 2 0.85,0
PANASONIC_C = smd 3.2 x 1.4: + 2.378,0; - -2.478,0
C1206 = smd 1.6 x 1.8: 1 -1.4,0; 2 1.4,0
C0805 = smd 1.3 x 1.5: 1 -0.95,0; 2 0.95,0
SOD123 = smd 1.6 x 0.8: + 1.7,0; - -1.7,0
PCB_SCREW = drill 3.1 pad 5: P$1 0,0
WE78 = drill 0.9 pad 1.93: 1 -2.54,0; 2 0,0; 3 2.54,0
TQFP-10X10-64 = smd 1.2 x 0.3: 1 -5.936,3.75; 2 -5.936,3.25; 3 -5.936,2.75; 4 -5.936,2.25; 5 -5.936,1.75; 6 -5.936,1.25; 7 -5.936,0.75; 8 -5.936,0.25; 9 -5.936,-0.25; 10 -5.936,-0.75; 11 -5.936,-1.25; 12 -5.936,-1.75; 13 -5.936,-2.25; 14 -5.936,-2.75; 15 -5.936,-3.25; 16 -5.936,-3.75; 33 5.886,-3.75; 34 5.886,-3.25; 35 5.886,-2.75; 36 5.886,-2.25; 37 5.886,-1.75; 38 5.886,-1.25; 39 5.886,-0.75; 40 5.886,-0.25; 41 5.886,0.25; 42 5.886,0.75; 43 5.886,1.25; 44 5.886,1.75; 45 5.886,2.25; 46 5.886,2.75; 47 5.886,3.25; 48 5.886,3.75 | smd 0.3 x 1.2: 17 -3.75,-5.911; 18 -3.25,-5.911; 19 -2.75,-5.911; 20 -2.25,-5.911; 21 -1.75,-5.911; 22 -1.25,-5.911; 23 -0.75,-5.911; 24 -0.25,-5.911; 25 0.25,-5.911; 26 0.75,-5.911; 27 1.25,-5.911; 28 1.75,-5.911; 29 2.25,-5.911; 30 2.75,-5.911; 31 3.25,-5.911; 32 3.75,-5.911; 49 3.75,5.936; 50 3.25,5.936; 51 2.75,5.936; 52 2.25,5.936; 53 1.75,5.936; 54 1.25,5.936; 55 0.75,5.936; 56 0.25,5.936; 57 -0.25,5.936; 58 -0.75,5.936; 59 -1.25,5.936; 60 -1.75,5.936; 61 -2.25,5.936; 62 -2.75,5.936; 63 -3.25,5.936; 64 -3.75,5.936
SOT89 = smd 1 x 1.5: 1 -1.499,-1.981; 3 1.499,-1.981 | smd 1 x 2: 2 0,-1.727 | smd 2.2 x 3.7: 2@1 0,0.94
SOP65P640X110-16N = smd 1.422 x 0.356: 1 -2.845,2.286; 2 -2.845,1.626; 3 -2.845,0.965; 4 -2.845,0.33; 5 -2.845,-0.33; 6 -2.845,-0.965; 7 -2.845,-1.626; 8 -2.845,-2.286; 9 2.845,-2.286; 10 2.845,-1.626; 11 2.845,-0.965; 12 2.845,-0.33; 13 2.845,0.33; 14 2.845,0.965; 15 2.845,1.626; 16 2.845,2.286
TSSOP14_065 = smd 0.305 x 0.991: 1 -1.95,-2.718; 2 -1.3,-2.718; 3 -0.65,-2.718; 4 0,-2.718; 5 0.65,-2.718; 6 1.3,-2.718; 7 1.95,-2.718; 8 1.95,2.718; 9 1.3,2.718; 10 0.65,2.718; 11 0,2.718; 12 -0.65,2.718; 13 -1.3,2.718; 14 -1.95,2.718
SOT23 = smd 1 x 1.4: 1 -0.95,-1.1; 2 0.95,-1.1; 3 0,1.1
1X04 = drill 1.016 pad 1.88 square: 1 0,0 | drill 1.016 pad 1.88: 2 2.54,0; 3 5.08,0; 4 7.62,0
1X02 = drill 1.016 pad 1.88: 1 0,0; 2 2.54,0
1X03 = drill 1.016 pad 1.88: 1 -2.54,0; 2 0,0; 3 2.54,0
2X5-1.27 = drill 0.61 pad 1.067: 1 -0.635,2.54; 2 0.635,2.54; 3 -0.635,1.27; 4 0.635,1.27; 5 -0.635,0; 6 0.635,0; 7 -0.635,-1.27; 8 0.635,-1.27; 9 -0.635,-2.54; 10 0.635,-2.54
1X01 = drill 1.016 pad 1.88: 1 0,0
L2012C = smd 0.9 x 1.25: 1 -0.9,0; 2 1,0
POWER_10 = drill 1.016 pad 1.88: 1 -5.08,-1.27; 2 -5.08,1.27; 3 -2.54,-1.27; 4 -2.54,1.27; 5 0,-1.27; 6 0,1.27; 7 2.54,-1.27; 8 2.54,1.27; 9 5.08,-1.27; 10 5.08,1.27
CTS406 = smd 1.9 x 1.4: 1 -2.2,-1.2; 2 2.2,-1.2; 3 2.2,1.2; 4 -2.2,1.2

### Placement (x,y rotation side)
C1  5.71,60.64 270 top
C2  11.75,61.91 0 top
C3  7.3,57.47 180 top
C4  34.92,54.61 90 top
C5  7.3,54.93 180 top
C6  26.04,54.61 270 top
C7  47.31,49.21 180 top
C8  40.32,46.35 180 top
C9  23.81,49.53 0 top
C10  18.57,47.31 180 top
C11  39.69,59.85 270 top
C12  33.66,44.77 270 top
C13  16.19,43.5 90 top
C14  7.3,52.39 0 top
C15  18.1,33.34 270 top
C16  20,33.34 270 top
C17  5.08,40.96 0 top
C18  16.51,53.02 180 top
C19  31.11,33.34 270 top
C20  29.21,30.8 270 top
C21  38.73,30.48 0 top
C25  38.73,40.64 180 top
C26  38.73,42.39 0 top
C30  33.97,9.52 90 top
C31  46.04,9.52 90 top
C32  33.97,3.81 270 top
C33  46.04,3.81 270 top
C40  4.45,3.81 270 top
C41  16.51,3.81 270 top
C42  4.45,9.52 90 top
C46  34.61,6.67 180 top
C47  5.08,6.67 180 top
C52  2.54,49.85 0 top
D1  17.46,61.6 90 top
D2  33.34,61.6 270 top
F1  20.32,57.79 180 top
F2  35.56,60.32 270 top
F3  10.95,52.39 90 top
H1  15.35,68.12 0 top
H2  35.16,68.12 0 top
IC1  2.86,59.69 90 bottom
IC2  25.72,40.32 270 top
IC3  7.3,46.99 180 top
IC4  38.42,35.56 270 top
IC5  10.48,6.67 270 top
IC6  40.01,6.67 270 top
IC8  2.54,46.67 180 top
JP1  48.26,37.78 90 bottom
JP2  48.26,53.34 90 bottom
JP3  1.59,30.8 270 bottom
JP4  48.26,31.59 180 bottom
JP38  38.73,21.27 0 top
JP39  19.68,13.65 0 top
JP40  19.68,16.19 0 top
JP41  30.8,13.65 0 top
JP42  11.75,21.27 0 top
JP49  4.13,16.19 0 top
JP50  4.13,18.73 0 top
JP52  4.13,13.65 0 top
JP53  19.68,21.27 0 top
JP54  19.68,18.73 0 top
JP55  30.8,21.27 0 top
JP56  30.8,18.73 0 top
JP57  46.35,13.65 0 top
JP59  46.35,18.73 0 top
JP61  46.35,16.19 0 top
JP63  9.21,16.19 0 top
JP64  9.21,13.65 0 top
JP65  41.27,16.19 0 top
JP66  30.8,16.19 0 top
JP67  22.86,67.94 0 top
JP68  25.4,67.94 0 top
JP69  4.13,67.94 0 top
JP70  1.59,67.94 0 top
JP71  1.59,21.27 0 top
JP72  48.9,67.94 0 top
JP73  46.35,67.94 0 top
JP74  48.9,21.27 0 top
JP75  20.32,67.94 0 top
JP76  9.21,67.94 0 top
JP77  30.48,67.94 0 top
JP78  41.27,67.94 0 top
JP79  38.73,18.73 0 top
JP80  9.21,18.73 0 top
JP81  6.67,67.94 0 top
JP82  43.81,67.94 0 top
JP83  41.27,18.73 0 top
JP84  27.94,67.94 0 top
JP85  11.75,13.65 0 top
JP86  11.75,16.19 0 top
JP87  4.13,21.27 0 top
JP88  9.21,21.27 0 top
JP89  46.35,21.27 0 top
JP90  41.27,21.27 0 top
JP91  38.73,13.65 0 top
JP92  38.73,16.19 0 top
JP93  41.27,13.65 0 top
JP94  48.9,18.73 0 top
JP95  48.9,16.19 0 top
JP96  48.9,13.65 0 top
JP97  1.59,18.73 0 top
JP98  1.59,16.19 0 top
JP99  1.59,13.65 0 top
JP100  11.75,18.73 0 top
L1  10.79,56.2 90 top
P1  25.4,61.6 0 bottom
Q1  30.48,54.61 0 top
R2  47.31,58.1 180 top
R3  46.2,54.29 90 top
R6  47.31,47.62 180 top
R7  28.57,51.43 180 top
R8  32.38,51.43 0 top
R28  47.62,9.52 90 top
R29  32.38,3.81 90 top
R30  32.38,9.52 90 top
R31  47.62,3.81 90 top
R39  35.56,9.52 270 top
R40  44.45,9.52 270 top
R41  35.56,3.81 90 top
R42  44.45,3.81 90 top
R57  6.03,3.81 90 top
R58  14.92,3.81 90 top
R59  6.03,9.52 270 top
R68  2.54,51.75 180 top
R70  2.86,3.81 270 top
R71  18.1,3.81 270 top
R72  2.86,9.52 270 top
U$1  [LOGO_30]  25.08,31.43 0 bottom

### Tracks (layer width: path | path; a pad name or v marks a point on that pad's centre or on a via)
+3V3  (via drill 0.3)
  Top 0.305: IC2.64 32.11,44.07 C12.1 | 20,34.77 20,36.38 IC2.32 | IC4.12 38.1,32.7 38.1,31.12 37.88,30.9 C21.1 v36.67,30.48 | C12.1 33.87,45.62 35.88,47.62 R6.2 | C12.1 33.66,45.72 32.86,46.51 29.72,46.51 IC2.1 | v32.23,27.3 32.23,33.65 31.69,34.19 C19.1 30.87,34.44 IC2.48 29.47,35.62 v29.37,35.72 28.57,35.72 27.46,36.83 27.46,40.64 28.89,42.07 v28.89,42.7 | v34.13,22.23 v34.13,20.16 | 16.19,42.54 C13.1 16.62,43.07 | C16.1 20,34.77 | 20,34.77 v19.05,35.72 | IC2.19 16.62,43.07 | 16.62,43.07 16.62,42.97 16.19,42.54 | 16.19,42.54 16.19,42.07 16.51,41.75 16.51,37.15 v16.03,36.67 15.08,36.67 12.06,39.69 12.06,47.94 v13.49,49.37 | v13.49,50.96 13.49,52.38 C18.+ | v35.08,43.5 35.08,44.19 C12.1 | v44.93,26.03 v47.62,26.03
  Top 0.406: C1.1 4.98,62.23 IC1.3 4.45,63.82 10.79,63.82 11.75,62.87 11.75,59.37 14.13,56.99 C18.+
  Bottom 0.305: v32.23,27.3 34.13,25.4 | v36.67,30.48 39.05,28.1 | 39.05,28.1 39.05,26.03 38.42,25.4 34.13,25.4 | 34.13,25.4 v34.13,22.23 | v34.13,20.16 34.13,16.99 JP41.1 | v16.03,36.67 18.1,36.67 v19.05,35.72 v29.37,35.72 | v13.49,49.37 v13.49,50.96 | v28.89,42.7 28.89,42.86 29.84,43.82 34.77,43.82 v35.08,43.5 | 39.05,28.1 42.86,28.1 v44.93,26.03 | v47.62,26.03 JP4.1
+3V3_A  (via drill 0.3)
  Top 0.305: IC2.13 23.47,46.99 | 23.47,46.99 23.15,47.31 C10.1 19.37,47.31 19.37,48.26 17.46,50.16 9.99,50.16 IC3.1 8.89,48.88 8.89,42.23 7.62,40.96 | C17.+ 7.62,40.96 | 23.47,46.99 23.47,47.02 23.18,47.31 23.18,49.32 C9.1 v21.59,49.53 | C47.1 IC5.4 v8.89,6.67 | IC6.4 C46.1 34.51,5.71 32.7,5.71 v31.75,6.67 | 37.88,46.29 C26.1 37.88,42.28 38.73,41.43 38.73,38.42 IC4.4 | 37.88,46.29 C8.+ | 7.62,40.96 v7.62,28.42 | v16.67,21.27 16.67,6.67 | 16.67,6.67 v14.76,6.67 | 16.67,6.67 v28.26,6.67 | 37.88,46.29 40.26,46.29 v40.32,46.35
  Bottom 0.305: v7.62,28.42 4.6,28.42 3.81,27.62 3.81,24.29 4.6,23.49 9.53,23.49 JP42.1 v16.67,21.27 | v8.89,6.67 v14.76,6.67 | v28.26,6.67 v31.75,6.67 | v40.32,46.35 40.32,52.86 35.4,57.79 24.13,57.79 21.59,55.24 v21.59,49.53
ADC_DV_CV  (via drill 0.3)
  Top 0.152: C33.2 R42.1 43.55,2.96 42.7,3.81 42.7,4.7 IC6.8 41.64,4.72 40.64,5.71 40.64,8.57 44.13,12.06 44.13,15.56 43.81,15.88 43.81,21.11 38.73,26.19 v38.1,26.19 | IC2.21 v21.11,42.07
  Bottom 0.152: v38.1,26.19 37.47,26.19 36.04,27.62 33.34,27.62 32.07,28.89 32.07,34.13 28.89,37.31 28.89,39.69 26.51,42.07 v21.11,42.07
ADC_DV_POT
  Top 0.152: IC2.11 24.45,46.28 24.45,47.94 23.81,48.58 23.81,50.48 24.45,51.12 24.45,57.15 26.67,59.37 26.67,64.13 JP67.1
ADC_LENGTH_POT  (via drill 0.3)
  Top 0.152: JP68.1 25.4,66.99 27.94,64.45 41.91,64.45 43.02,63.34 43.02,57.47 36.83,51.28 35.88,51.28 v35.08,50.48 | v30.32,45.72 29.05,44.45 27.15,44.45 25.24,42.54 25.24,40.01 24.29,39.05 19.83,39.05 IC2.27
  Bottom 0.152: v35.08,50.48 v30.32,45.72
ADC_T_BIAS_CV  (via drill 0.3)
  Top 0.152: C40.2 R57.1 6.03,2.99 IC5.7 9.64,4.72 11.59,6.67 11.59,11.59 15.08,15.08 15.08,23.18 v15.56,23.65 | v13.18,45.09 13.18,47.47 14.13,48.42 15.08,48.42 15.56,47.94 15.56,46.2 16.03,45.72 18.41,45.72 19.53,44.61 21.59,44.61 22.38,45.4 22.54,46.18 IC2.15
  Bottom 0.152: v13.18,45.09 13.18,43.82 13.65,43.34 13.65,29.05 16.35,26.35 18.73,26.35 19.21,25.88 19.21,24.29 17.78,22.86 16.35,22.86 v15.56,23.65
ADC_T_BIAS_POT  (via drill 0.3)
  Top 0.152: JP69.1 2.86,66.68 1.75,66.68 0.95,65.88 0.95,55.09 v2.7,53.34 | v17.14,48.74 18.26,48.74 18.57,48.42 18.57,46.51 18.89,46.2 21.91,46.2 IC2.16
  Bottom 0.152: v2.7,53.34 4.29,54.93 5.4,54.93 14.13,46.2 16.35,46.2 16.83,46.67 16.83,48.42 v17.14,48.74
ADC_T_JITTER_CV  (via drill 0.3)
  Top 0.152: C42.2 R59.1 | R59.1 6.93,10.38 7.78,9.52 7.78,8.64 IC5.1 | R59.1 6.35,10.69 6.35,23.81 7.14,24.61 v7.62,24.61 | v4.6,25.56 4.6,26.03 6.03,27.46 13.49,27.46 16.19,30.16 16.19,35.24 17.14,36.2 17.14,41.75 17.94,42.54 19.78,42.54 IC2.20
  Bottom 0.152: v7.62,24.61 5.56,24.61 v4.6,25.56
ADC_T_JITTER_POT
  Top 0.152: JP71.1 1.59,21.43 5.4,25.24 5.4,26.35 6.19,27.15 13.65,27.15 16.51,30 16.51,35.08 17.46,36.04 17.46,39.53 17.94,40.01 19.74,40.01 IC2.25
ADC_T_RATE_CV  (via drill 0.3)
  Top 0.152: C41.2 R58.1 14.92,2.99 IC5.8 12.74,4.72 11.91,5.56 11.91,11.43 15.4,14.92 15.4,22.23 v15.72,22.54 | v13.97,44.13 13.97,47.78 14.29,48.1 14.92,48.1 15.24,47.78 15.24,46.04 15.88,45.4 18.26,45.4 19.53,44.13 arc-53 IC2.17
  Bottom 0.152: v15.72,22.54 17.94,22.54 19.53,24.13 19.53,26.03 18.89,26.67 16.51,26.67 13.97,29.21 v13.97,44.13
ADC_T_RATE_POT  (via drill 0.3)
  Top 0.152: JP70.1 0.64,66.99 0.64,54.45 2.38,52.71 3.02,52.71 v3.81,53.34 | IC2.10 24.97,44.41 v25.08,44.29
  Bottom 0.152: v3.81,53.34 3.81,53.98 4.45,54.61 5.24,54.61 16.67,43.18 22.38,43.18 23.5,44.29 v25.08,44.29
ADC_X_BIAS_CV  (via drill 0.3)
  Top 0.152: IC6.1 37.31,8.64 37.31,9.52 36.46,10.38 R39.1 C30.2 33.97,15.56 32.07,17.46 30,17.46 25.56,21.91 25.56,26.19 26.04,26.67 v26.04,26.99 | IC2.24 18.64,40.57 v18.57,40.64
  Bottom 0.152: v18.57,40.64 15.08,40.64 14.61,40.16 14.61,29.53 16.83,27.3 23.5,27.3 23.81,27.62 25.4,27.62 v26.04,26.99
ADC_X_BIAS_POT  (via drill 0.3)
  Top 0.152: JP73.1 44.93,66.52 44.93,56.51 36.83,48.42 36.2,48.42 35.24,49.37 29.84,49.37 v29.53,49.05 | IC2.9 25.47,48.19 v25.4,48.26
  Bottom 0.152: v29.53,49.05 26.19,49.05 v25.4,48.26
ADC_X_SPREAD_CV  (via drill 0.3)
  Top 0.152: R40.1 43.55,10.38 42.7,9.52 42.7,8.64 IC6.14 | R40.1 C31.2 | R40.1 44.45,15.72 44.13,16.03 44.13,21.27 38.26,27.15 v37.47,27.15 | IC2.23 19.85,41.12 21.27,41.12 21.75,40.64 22.54,40.64 23.02,41.12 v23.02,42.86 23.02,46.21 IC2.14
  Bottom 0.152: v37.47,27.15 36.67,27.94 33.5,27.94 32.38,29.05 32.38,34.29 29.21,37.46 29.21,39.85 26.19,42.86 v23.02,42.86
ADC_X_SPREAD_POT  (via drill 0.3)
  Top 0.152: JP72.1 48.9,66.99 48.58,66.68 45.56,66.68 45.24,66.36 45.24,56.36 36.99,48.1 36.04,48.1 35.08,49.05 30.48,49.05 29.37,47.94 v28.73,47.94 | IC2.8 25.97,47.4 v26.19,47.62
  Bottom 0.152: v28.73,47.94 26.51,47.94 v26.19,47.62
ADC_X_STEPS_CV  (via drill 0.3)
  Top 0.152: C32.2 R41.1 36.46,2.96 37.31,3.81 37.31,4.7 IC6.7 38.53,4.72 v38.58,4.6 | v29.21,5.71 29.21,17.3 24.92,21.59 24.92,26.19 v24.13,26.99 | IC2.22 18.75,41.57 v18.57,41.75
  Bottom 0.152: v38.58,4.6 30.32,4.6 v29.21,5.71 | v24.13,26.99 16.67,26.99 14.29,29.37 14.29,40.32 14.92,40.96 17.78,40.96 v18.57,41.75
ADC_X_STEPS_POT  (via drill 0.3)
  Top 0.152: JP74.1 47.31,22.86 44.93,22.86 43.81,23.97 v43.81,24.77 | v41.27,25.08 40.8,25.08 37.62,28.26 v37.47,28.26 | IC2.26 20.52,39.57 20.8,39.85 v23.65,39.85 | v28.26,39.21 v29.84,39.21
  Bottom 0.152: v43.81,24.77 41.59,24.77 v41.27,25.08 | v37.47,28.26 33.66,28.26 32.7,29.21 32.7,34.45 29.53,37.62 29.53,38.89 v29.84,39.21 | v23.65,39.85 27.62,39.85 v28.26,39.21
AREF_-10  (via drill 0.3)
  Top 0.305: IC8.2 1.59,44.13 3.02,42.7 4.29,42.7 5.08,41.91 5.08,27.62 v2.86,25.4 | v1.11,11.27 1.11,10.42 R72.2 2.8,8.67 1.75,7.62 1.75,4.07 R70.2 2.86,2.22 3.65,1.43 17.3,1.43 18.1,2.22 R71.2 29.47,2.96 29.53,3.02 | 32.07,4.6 32.33,4.6 R29.2 | R29.2 32.12,4.66 32.07,4.6 | 32.07,4.6 31.91,4.6 | 31.11,4.6 29.53,3.02 | 29.53,3.02 31.11,1.43 48.42,1.43 49.21,2.22 49.21,3.97 48.42,4.76 | R31.2 47.73,4.76 48.42,4.76 | 48.42,4.76 49.21,5.56 49.21,9.84 48.58,10.48 47.73,10.48 R28.2 | R29.2 31.96,4.66 31.91,4.6 | 31.91,4.6 31.11,4.6 | 31.11,4.6 30.32,5.4 30.32,9.68 31.11,10.48 32.28,10.48 R30.2
  Top 0.406: R68.2 C52.1 1.69,47.87 IC8.2
  Bottom 0.305: v2.86,25.4 2.86,13.02 v1.11,11.27
DAC_MOSI
  Top 0.152: IC4.11 37.45,33.99 32.86,38.58 IC2.53
DAC_SCK
  Top 0.152: IC4.10 36.79,34.17 33.34,37.62 31.7,37.62 IC2.51
DAC_SS  (via drill 0.3)
  Top 0.152: IC2.50 33.41,37.07 36.13,34.35 IC4.9 36.13,31.65 v36.35,31.43 | v48.26,35.4 46.35,35.4 44.93,33.97 v44.93,32.54
  Bottom 0.152: v44.93,32.54 43.97,31.59 36.35,31.59 v36.35,31.43 | JP4.8 49.69,33.65 49.69,34.93 49.21,35.4 v48.26,35.4
DAC_X_1
  Top 0.152: JP94.1 47.62,20 45.72,20 45.09,20.64 45.09,21.75 42.7,24.13 42.7,34.45 40.04,37.11 IC4.2
DAC_X_2
  Top 0.152: JP95.1 47.62,17.46 45.72,17.46 44.77,18.41 44.77,21.59 42.39,23.97 42.39,34.29 39.85,36.83 37.62,36.83 36.79,37.66 IC4.7
DAC_X_3
  Top 0.152: JP96.1 47.62,14.92 45.72,14.92 44.45,16.19 44.45,21.43 42.07,23.81 42.07,34.13 39.69,36.51 37.31,36.51 36.13,37.69 IC4.8
DAC_Y  (via drill 0.3)
  Top 0.152: JP93.1 43.5,15.88 43.5,20.95 39.69,24.77 v39.21,24.77 | IC4.1 40.7,36.93 43.02,34.61 43.02,26.67 v43.34,26.35
  Bottom 0.152: v39.21,24.77 40.8,26.35 v43.34,26.35
DEPRECATED
  Top 0.152: IC5.13 IC5.14
GATE_T_1  (via drill 0.3)
  Top 0.152: JP97.1 2.86,20 4.76,20 5.4,20.64 5.4,24.29 6.03,24.92 6.03,26.03 6.51,26.51 13.97,26.51 18.1,30.64 20.48,30.64 21.59,31.75 21.59,36.04 23.65,38.1 v25.72,38.1 | IC2.52 28.29,38.07 v28.26,38.1
  Bottom 0.152: v25.72,38.1 v28.26,38.1
GATE_T_2  (via drill 0.3)
  Top 0.152: JP98.1 2.86,17.46 4.76,17.46 5.71,18.41 5.71,24.13 6.83,25.24 v6.83,25.88 | IC2.44 27.47,32.87 24.92,30.32 23.02,30.32 20.16,27.46 18.89,27.46 16.83,25.4 v16.83,24.77
  Bottom 0.152: v16.83,24.77 8.73,24.77 7.62,25.88 v6.83,25.88
GATE_T_3  (via drill 0.3)
  Top 0.152: JP99.1 2.86,14.92 4.76,14.92 6.03,16.19 6.03,23.97 7.46,25.4 v12.38,25.4 | IC2.45 27.97,32.89 25.08,30 23.18,30 20.32,27.15 19.05,27.15 17.94,26.03 v17.94,25.08
  Bottom 0.152: v17.94,25.08 17.62,25.4 v12.38,25.4
GND  (via drill 0.3)
  Top 0.152: Q1.2 34.58,53.41 C4.1 34.98,53.8 35.97,53.8 36.01,53.84 | IC5.10 IC5.11 IC5.12 13.26,7.39 13.64,7.39 14.21,7.96 | IC2.60 30.48,42.07 v30.48,41.91 | IC2.12 v23.97,45.09 24,45.03 24.08,44.96 24.08,41.15 v24.13,41.12 | IC6.5 37.77,6.02 38.1,6.35 38.1,6.98 38.09,7 | 38.09,7 37.78,7.3 37.3,7.3 IC6.3 36.34,7.32 36.04,7.62 34.71,7.62 C46.2 | IC6.10 IC6.11 | IC6.11 42.72,7.01 | 42.72,7.01 IC6.12 | JP40.1 JP54.1 19.66,18.74 19.66,19.2 16.92,21.95 16.38,21.95 16,21.56 16,9.75 14.21,7.96 | C13.2 17.36,44.35 v17.46,44.45 | v15.88,48.74 17.14,47.47 17.46,47.47 C10.2 | JP56.1 30.79,18.74 30.79,21.26 JP55.1 | IC5.5 7.7,5.94 6.63,5.94 6.55,5.87 5.03,5.87 4.27,6.63 C47.2 4.42,6.55 5.33,7.47 6.55,7.47 6.63,7.39 7.7,7.39 IC5.3 7.77,7.39 8.69,7.39 v8.99,7.7 | v41.3,7.01 42.72,7.01 | v38.41,7.01 38.1,7.01 38.09,7 | v14.25,7.92 14.21,7.96 | v32.54,45.57 31.85,44.88 31.32,44.88 30.79,44.35 30.79,43.82 30.94,43.66 31.55,43.66 IC2.63 | v34.9,45.57 34.9,44.96 37.11,42.75 37.11,41.53 37.22,41.41 | 37.22,41.41 37.87,40.77 C25.2 | 20.77,38.21 20.8,38.18 20.8,33.38 20.04,32.61 C16.2 | 20.77,38.21 20.42,38.56 19.81,38.56 IC2.28 | C8.- 42.9,46.41 46.63,46.41 47.24,47.01 47.24,48.24 46.48,49 46.48,49.15 C7.2 46.41,49.23 44.42,49.23 42.75,50.9 42.75,51.43 v42.7,51.43 | v39.09,35.51 39.09,32.71 | 32.65,26.78 32.92,27.05 32.92,29.18 32.69,29.41 v32.69,35.89 31.24,35.89 30.02,37.11 v28.27,37.11 | 32.65,26.78 32.54,26.67 31.93,26.67 30.56,28.04 30.56,29.72 30.48,29.85 | v24.99,38.79 24.92,38.71 23.77,38.71 23.32,38.25 20.8,38.25 20.77,38.21 | v36.8,41 37.22,41.41 | P1.8 P1.7 | 36.99,54.83 39.62,57.46 C11.+
  Top 0.152: 36.99,54.83 36.73,54.56 | 36.73,54.56 36.01,53.84 | C9.2 24.69,49.53 24.69,50.9 25.22,51.43 25.22,54.63 25.98,55.4 C6.1 26.39,55.81 Q1.4 27.89,55.85 27.89,56.77 | 27.89,56.77 27.89,60.27 P1.3 | 36.99,54.83 35.05,56.77 27.89,56.77 | 5.87,56.31 5.87,57.46 C3.2 | 5.87,56.31 5.87,54.94 C5.2 | 5.87,56.31 11.35,56.31 11.66,56.62 11.66,57.84 8.87,60.62 | 6.44,47.89 7.16,48.62 IC3.2 | 6.44,47.89 6.4,47.85 3.66,47.85 IC8.1 3.5,47.62 v3.5,43.43 | v12.12,50.9 11.96,50.75 10.36,50.75 8.84,52.27 C14.2 | v2.36,42.29 2.59,42.06 2.59,41 C17.- 2.67,40.92 2.82,40.77 2.82,38.33 v2.86,38.26 2.9,38.25 2.9,36.58 v2.86,36.51 2.9,36.5 3.58,35.81 3.58,32.08 v3.65,32.07 3.58,32 3.58,28.57 1.45,26.44 1.45,26.21 v1.43,26.19 | v19.05,51.13 19.05,52.96 C18.- | 36.01,53.84 v37.19,52.65 | v32.69,25.83 32.69,26.75 32.65,26.78 | JP55.1 30.86,21.34 31.55,21.34 v32.69,22.48 33.07,22.86 34.44,22.86 35.2,22.1 35.36,22.1 v35.4,22.07 | v48.1,60.32 48.08,60.35 48.08,63.02 47.02,64.08 v46.99,64.13 | v7.94,70.33 8,70.26 8.61,70.26 11.43,67.44 v11.43,66.52 11.43,66.45 12.88,65 16.61,65 17.45,65.84 18.82,65.84 v18.89,65.88 | v10.32,29.05 10.29,29.11 9.37,30.02 9.37,32 v9.37,32.07 9.37,32.08 10.44,33.15 10.44,35.05 v10.48,35.08 10.52,35.13 10.52,38.71 v10.48,38.74 10.59,38.71 10.59,44.27 v10.64,44.29 | JP4.9 JP4.7 JP4.5 | v45.88,23.49 45.95,23.55 48.16,23.55 49,24.38 v49.05,24.45 49.07,24.46 49.07,25.83 v49.05,25.88 | v44.93,31.12 44.96,31.17 47.24,31.17 47.62,31.55 JP4.5 | JP4.3 47.62,30.86 47.32,31.17 JP4.5 | v7.14,17.46 7.16,17.53 7.16,19.74 7.39,19.96 v7.46,20 7.47,20.04 7.47,21.26 10.13,23.93 10.59,23.93 v10.64,23.97
  Top 0.152: v23.5,14.76 23.55,14.78 23.55,15.62 25.53,17.6 v25.56,17.62 | v40.32,27.15 40.31,27.2 40.31,28.42 39.85,28.88 v39.85,28.89 | v46.04,7.46 46.02,7.39 45.34,7.39 44.73,6.78 42.75,6.78 IC6.11 | v27.78,23.49 27.81,23.47 28.65,23.47 30.79,21.34 JP55.1 | v41.12,30.8 41.07,30.79 39.93,30.79 39.7,30.56 C21.2 | 36.73,54.56 37.11,54.18 v37.15,54.13 | v20,55.24 v16.51,55.24 | 40.59,44.14 42.82,41.91 v42.86,41.91 | 6.44,47.89 7.24,47.09 7.24,46.1 IC3.2@1
  Top 0.305: IC2.63 33.31,43.57 C12.2 | IC2.18 16.75,43.57 16.51,43.82 16.51,44.03 C13.2 | C16.2 18.52,32.49 C15.2 | C19.2 31.11,30.48 30.48,29.85 28.89,29.85 C20.2 | IC4.14 39.38,30.68 C21.2 | IC4.14 IC4.15 IC4.16 | IC4.13 39.09,32.71 IC4.14 | C25.2 38.09,40.44 IC4.5 IC4.6 | C26.2 39.59,43.14 40.59,44.14 C8.-
  Top 0.406: C2.- 9.21,61.85 9.21,60.96 8.87,60.62 8.04,59.79 C1.2 2.96,59.79 IC1.2 | C52.2 3.39,47.87 IC8.1 | IC3.2 7.3,50.99 C14.2
  Bottom 0.152: v17.46,44.45 18.57,45.56 18.57,46.1 | 18.57,46.1 18.57,48.42 | 18.57,48.42 17.62,49.37 16.51,49.37 v15.88,48.74 15.85,48.69 15.7,48.54 13.41,48.54 12.12,49.84 v12.12,50.9 3.35,59.66 2.9,59.66 IC1.2 | 39.55,7.01 v38.41,7.01 32.31,7.01 27.81,11.51 23.55,11.51 | 39.55,7.01 v41.3,7.01 42.52,5.79 46.79,5.79 49,8 49,11.58 v49.05,11.59 | 20.5,11.51 20.12,11.51 18.52,13.11 18.52,15.01 19.66,16.15 JP40.1 | 20.5,11.51 23.55,11.51 | 10.67,7.7 14.02,7.7 v14.25,7.92 | 10.67,7.7 v8.99,7.7 | 22.55,18.74 19.74,18.74 JP54.1 | 22.55,18.74 25.6,18.74 | 25.6,18.74 29.57,18.74 | 29.57,18.74 30.79,18.74 JP56.1 | v32.54,45.57 v34.9,45.57 34.9,46.48 37.19,48.77 37.19,51.13 | 32.54,41.91 32.69,41.91 33.68,42.9 34.75,42.9 36.69,40.96 | 32.54,41.91 v30.48,41.91 | 36.69,40.96 38.56,39.09 39.09,39.09 | 45.87,39.09 46.94,39.09 48.23,37.79 JP1.1 | 45.87,39.09 42.9,39.09 | 42.9,39.09 39.09,39.09 | 39.09,39.09 v39.09,35.51 | v32.69,35.89 32.69,39.7 32.54,39.85 32.54,41.91 | v24.99,38.79 24.99,37.87 25.49,37.38 | 25.49,37.38 25.76,37.11 v28.27,37.11 | v36.8,41 36.73,41 36.69,40.96 | 25.45,62.87 P1.4 27.96,62.87 29.18,61.65 34.98,61.65 36.2,62.87 36.2,65 | P1.5 25.45,60.35 27.89,60.35 P1.3 | P1.5 25.38,60.35 22.86,60.35 P1.7 22.86,57.07 20.54,54.75 | 25.45,62.87 25.45,60.43 P1.5 | 25.45,62.87 P1.6 | 18.57,46.1 21.18,46.1 22.17,45.11 23.93,45.11 v23.97,45.09 | v3.5,43.43 v2.36,42.29 | 20.16,49.42 19.2,48.46 18.59,48.46 18.57,48.42 | 20.16,49.42 20.19,49.45 20.19,49.99 v19.05,51.13 19.13,51.13 19.13,53.34 20.54,54.75 | v37.19,52.65 37.19,51.13 | v32.69,25.83 v32.69,22.48 | JP4.3 46.83,29.53 46.83,25.4 47.78,24.45 v49.05,24.45
  Bottom 0.152: 41.11,66.1 42.6,67.59 42.6,68.43 44.27,70.1 45.03,70.1 v45.09,70.17 | 41.11,66.1 41.07,66.06 39.09,66.06 v39.05,66.04 39.01,65.99 37.41,65.99 36.42,65 36.2,65 | v46.99,64.13 46.94,64.16 42.22,64.16 41.15,65.23 41.15,66.06 41.11,66.1 | v18.89,65.88 18.9,65.91 18.97,65.99 27.74,65.99 v27.78,66.04 27.81,65.99 28.8,65 36.2,65 | v23.81,1.91 23.77,1.91 23.77,9.45 23.55,9.68 v23.5,9.68 23.55,9.75 23.55,11.51 | v16.51,55.24 16.54,55.24 16.54,56.85 17.6,57.91 v17.62,57.94 | 39.55,7.01 39.55,3.05 v39.53,3.02 | v8.99,7.7 8.23,6.93 8.23,6.4 10.59,4.04 10.59,3.2 v10.64,3.17 | 10.67,7.7 10.67,8.99 v10.64,9.05 | 20.5,11.51 20.5,9.75 v20.48,9.68 | v8.99,7.7 8.91,7.7 5.11,11.51 5.11,12.04 v5.08,12.06 5.11,12.12 7.62,14.63 7.62,16.46 7.16,16.92 7.16,17.45 v7.14,17.46 | 20.54,54.75 20.04,55.24 v20,55.24 | 29.57,18.74 29.57,13.18 30.33,12.42 31.24,12.42 32.46,13.64 32.84,13.64 v32.86,13.65 | 22.55,18.74 22.55,24.08 v22.54,24.13 | 25.49,37.38 24.99,36.88 v24.92,36.83 | 42.9,39.09 42.9,41.91 v42.86,41.91 | 45.87,39.09 45.87,37.49 v45.88,37.46 | 20.16,49.42 21.26,48.31 21.72,48.31 v21.75,48.26 | v30.96,47.62 31.32,47.62 34.82,51.13 37.19,51.13 | v39.85,28.89 39.85,28.96 39.85,29.57 41.07,30.79 v41.12,30.8 41.15,30.86 41.38,31.09 44.88,31.09 v44.93,31.12 | 25.6,18.74 25.6,17.68 v25.56,17.62 | v9.37,32.07 9.3,32.08 3.66,32.08 v3.65,32.07
  pour Top: -0.32,-0.16 50.8,-0.16 50.8,72.07 -0.32,72.07
  pour Bottom: -0.32,-0.16 50.8,-0.16 50.8,72.07 -0.32,72.07
L_DV_CV  (via drill 0.3)
  Top 0.152: R31.1 47.62,3.07 C33.1 R42.2 44.39,4.66 43.66,5.4 42.75,5.4 IC6.9 42.58,5.37 42.55,5.4 41.91,5.4 v41.43,5.87
  Bottom 0.152: JP63.1 10.48,17.46 12.38,17.46 15.72,14.13 15.72,1.91 16.67,0.95 40.64,0.95 41.59,1.91 41.59,5.71 v41.43,5.87
L_T_BIAS_CV  (via drill 0.3)
  Top 0.152: R70.1 C40.1 R57.2 6.09,4.66 6.83,5.4 7.73,5.4 IC5.6 8.7,5.37 9.68,6.35 9.68,10 6.99,12.7 v6.99,16.19
  Bottom 0.152: JP49.1 v6.99,16.19
L_T_JITTER_CV
  Top 0.152: IC5.2 7.73,7.94 7.14,7.94 6.41,8.67 R59.2 C42.1 2.86,10.26 R72.1 2.86,11.75 4.13,13.02 JP52.1
L_T_RATE_CV  (via drill 0.3)
  Top 0.152: R71.1 C41.1 R58.2 14.87,4.66 14.13,5.4 13.22,5.4 IC5.9 12.57,5.37 12.22,5.71 12.22,10.32 v12.7,10.8
  Bottom 0.152: v12.7,10.8 10.16,10.8 7.94,13.02 7.94,17.78 6.99,18.73 JP50.1
L_X_BIAS_CV  (via drill 0.3)
  Top 0.152: R30.1 C30.1 R39.2 36.27,7.97 IC6.2 39.08,7.97 42.7,11.59 42.7,14.13 v43.5,14.92
  Bottom 0.152: v43.5,14.92 45.09,14.92 JP61.1
L_X_SPREAD_CV  (via drill 0.3)
  Top 0.152: IC6.13 43.74,7.97 R40.2 | R40.2 C31.1 R28.1 | v44.45,7.46 R40.2
  Bottom 0.152: JP59.1 43.18,18.73 42.7,18.26 42.7,13.34 43.34,12.7 43.34,8.57 v44.45,7.46
L_X_STEPS_CV  (via drill 0.3)
  Top 0.152: R29.1 32.38,3.07 C32.1 R41.2 35.62,4.66 36.35,5.4 37.26,5.4 IC6.6 39.66,5.37 40.32,6.03 40.32,8.73 43.81,12.22 43.81,13.34 v43.5,13.65
  Bottom 0.152: v43.5,13.65 JP57.1
LED_T_DV  (via drill 0.3)
  Top 0.152: JP75.1 21.59,66.68 21.59,59.37 23.81,57.15 23.81,53.98 v19.53,49.69 | IC2.29 19.08,38.07 v18.1,39.05 | v15.24,39.05 13.34,39.05 12.54,39.85 12.54,47.31 14.45,49.21 v14.76,49.21
  Bottom 0.152: v18.1,39.05 v15.24,39.05 | v14.76,49.21 15.24,49.69 v19.53,49.69
LED_T_MODE_G
  Top 0.152: JP88.1 18.26,30.32 20.64,30.32 21.91,31.59 21.91,34.38 IC2.33
LED_T_MODE_R  (via drill 0.3)
  Top 0.152: JP87.1 4.13,23.49 5.71,25.08 5.71,26.19 6.35,26.83 13.81,26.83 17.14,30.16 v17.14,30.8 | IC2.34 22.47,33.25 v22.7,33.02
  Bottom 0.152: v22.7,33.02 21.43,33.02 19.68,31.27 17.62,31.27 v17.14,30.8
LED_T_RANGE_G
  Top 0.152: JP86.1 14.13,18.57 14.13,24.13 18.41,28.42 19.68,28.42 23.97,32.7 IC2.37
LED_T_RANGE_R  (via drill 0.3)
  Top 0.152: JP85.1 14.76,16.67 14.76,23.81 18.73,27.78 20,27.78 23.18,30.96 v24.45,30.96 | IC2.38 24.47,32.25 v24.45,32.23
  Bottom 0.152: v24.45,30.96 v24.45,32.23
LED_X_DV  (via drill 0.3)
  Top 0.152: JP77.1 28.89,69.53 22.23,69.53 21.59,68.9 21.59,67.31 24.13,64.77 24.13,53.18 v23.34,52.39 | IC2.62 30.59,43.07 v30.48,43.02
  Bottom 0.152: v23.34,52.39 24.61,52.39 25.4,51.59 25.4,49.37 24.61,48.58 24.61,47.94 25.4,47.15 25.4,44.93 26.35,43.97 26.35,43.18 28.1,41.43 28.89,41.43 v30.48,43.02
LED_X_EXT_G  (via drill 0.3)
  Top 0.152: JP84.1 27.94,67.15 30.16,64.93 v42.39,64.93 43.66,63.66 43.66,57.15 36.99,50.48 v36.35,50.48 | IC2.55 31.61,39.53 30.48,39.53 29.84,40.16 29.84,43.97 v31.43,45.56 | JP4.6 49.85,32.54 49.85,63.82 v48.74,64.93
  Bottom 0.152: v36.35,50.48 v31.43,45.56 | v48.74,64.93 v42.39,64.93
LED_X_MODE_G  (via drill 0.3)
  Top 0.152: JP90.1 35.24,27.3 35.24,33.81 v34.92,34.13 | IC2.59 33.32,41.57 v33.97,42.23
  Bottom 0.152: v34.92,34.13 34.61,34.45 34.61,40.64 34.77,40.8 34.77,41.43 v33.97,42.23
LED_X_MODE_R  (via drill 0.3)
  Top 0.152: JP89.1 46.35,22.07 45.88,22.54 44.77,22.54 43.02,24.29 43.02,24.92 43.97,25.88 43.97,27.15 43.34,27.78 v43.34,35.24 | v41.27,33.97 41.27,34.45 39.53,36.2 36.99,36.2 35.56,37.62 35.56,39.53 35.88,39.85 35.88,41.75 34.77,42.86 33.5,42.86 33.18,42.54 31.68,42.54 IC2.61
  Bottom 0.152: v43.34,35.24 42.07,33.97 v41.27,33.97
LED_X_RANGE_G  (via drill 0.3)
  Top 0.152: IC2.57 32.48,40.57 32.7,40.8 33.5,40.8 33.97,40.32 v35.24,40.32 | v35.88,28.89 35.56,28.57 35.56,27.46 40.16,22.86 v40.64,22.86
  Bottom 0.152: v35.24,40.32 34.92,40.01 34.92,35.08 35.56,34.45 35.56,29.21 v35.88,28.89 | JP92.1 40.01,17.46 40.01,22.23 v40.64,22.86
LED_X_RANGE_R  (via drill 0.3)
  Top 0.152: JP91.1 36.83,15.56 36.83,24.29 34.29,26.83 34.29,28.73 v33.34,29.69 | IC2.56 33.09,40.07 v33.18,40.16
  Bottom 0.152: v33.34,29.69 33.97,29.69 34.61,30.32 34.61,32.23 33.97,32.86 33.97,39.37 v33.18,40.16
N$1
  Top 0.406: P1.9 P1.10 19.89,63.29 D1.+
N$2
  Top 0.406: P1.1 P1.2 32.91,62.87 D2.-
N$3  (via drill 0.3)
  Top 0.305: v17.94,23.97 17.94,23.02 JP53.1
  Bottom 0.305: JP3.2 11.27,30.8 16.19,25.88 18.41,25.88 18.73,25.56 18.73,24.77 v17.94,23.97
N$4
  Top 0.305: F3.1 10.79,51.59 10,52.39 10,53.34 9.68,53.66 7.17,53.66 C14.1
  Top 0.406: IC3.3 5.8,52.29 C14.1
N$6  (via drill 0.3)
  Top 0.305: v13.18,56.51 11.96,55.3 L1.1 10.95,55.14 F3.2 | D1.- 16.56,59.9 v15.88,59.21
  Top 0.406: D1.- 17.46,59.79 F1.2 | L1.1 9.07,55.3 C5.1
  Bottom 0.305: v13.18,56.51 v15.88,59.21
N$7
  Top 0.152: R7.1 28.79,50.86 26.99,49.05 26.99,46.28 IC2.6
N$8
  Top 0.152: R8.1 31.54,51.22 30.8,50.48 28.89,50.48 27.46,49.05 IC2.5
N$10
  Top 0.406: D2.+ 35.14,59.9 F2.2
N$13
  Top 0.305: IC2.47 28.97,31.82 C20.1
N$19
  Top 0.305: IC2.31 18.66,37.07 18.1,36.51 C15.1
N$32
  Top 0.305: IC1.1 4.6,58.9 7.27,58.9 C3.1
  Top 0.406: L1.2 8.97,57.2 C3.1
N$33
  Top 0.152: JP2.2 48.26,58 R2.1
N$51
  Top 0.152: R3.1 48.16,53.44 JP2.1
N$62
  Top 0.152: Q1.3 33.34,55.81 | 33.34,55.81 34.58,55.81 C4.2 | R8.2 33.23,51.54 32.38,52.39 31.43,52.39 31.11,52.71 31.11,55.56 31.43,55.88 33.27,55.88 33.34,55.81
N$65
  Top 0.152: C6.2 26.39,53.41 Q1.1 28.28,51.99 R7.2
NORMALIZATION_PROBE  (via drill 0.3)
  Top 0.152: IC2.39 24.97,33.29 v25.24,33.02 | v25.24,28.89 25.24,21.75 JP66.1
  Bottom 0.152: v25.24,33.02 v25.24,28.89
RESET  (via drill 0.3)
  Top 0.152: IC2.7 26.47,44.97 v26.51,44.93 | v44.45,50.16 47.78,50.16 48.16,49.79 C7.1 R6.1 48.16,45.51 JP1.4 49.53,44.13 49.53,34.93 48.9,34.29 JP4.10
  Bottom 0.152: v26.51,44.93 43.66,44.93 44.77,46.04 44.77,49.85 v44.45,50.16
RX  (via drill 0.3)
  Top 0.152: IC2.43 26.97,42.21 v28.42,43.66 | R3.2 44.98,55.14 v44.93,55.09
  Bottom 0.152: v28.42,43.66 29.05,44.29 43.97,44.29 45.4,45.72 45.4,54.61 v44.93,55.09
SW_T_DV  (via drill 0.3)
  Top 0.152: JP76.1 7.3,66.04 2.06,66.04 1.59,65.56 1.59,56.67 v2.7,55.56 | IC2.30 18.47,37.57 v18.1,37.94 | v15.56,37.94 15.56,38.1 15.88,38.42 15.88,40.8 14.61,42.07 v14.61,47.31
  Bottom 0.152: v2.7,55.56 5.71,55.56 13.97,47.31 v14.61,47.31 | v15.56,37.94 v18.1,37.94
SW_T_MODE  (via drill 0.3)
  Top 0.152: JP81.1 5.08,66.36 1.91,66.36 1.27,65.72 1.27,55.88 v2.7,54.45 | IC2.35 22.97,36.3 v23.02,36.51 | v16.19,47.15 16.19,46.35 16.51,46.04 18.57,46.04 19.37,45.24 20.16,45.24 v20.32,45.4 | v22.23,43.97 v22.23,41.27
  Bottom 0.152: v2.7,54.45 3.49,55.24 5.56,55.24 14.29,46.51 15.56,46.51 v16.19,47.15 | v20.32,45.4 21.43,45.4 22.23,44.61 v22.23,43.97 | v23.02,36.51 23.02,40.48 v22.23,41.27
SW_T_RANGE
  Top 0.152: JP80.1 10.48,20 12.38,20 13.02,20.64 13.02,24.61 18.41,30 20.8,30 23.5,32.7 23.5,34.41 IC2.36
SW_X_DV
  Top 0.152: JP78.1 42.55,66.68 43.66,66.68 43.97,66.36 43.97,56.99 36.67,49.69 29.21,49.69 27.94,48.42 27.94,46.29 IC2.4
SW_X_EXT  (via drill 0.3)
  Top 0.152: JP79.1 37.15,20.32 37.15,24.45 34.61,26.99 34.61,31.27 v33.97,31.91 | IC2.54 33.32,39.07 v33.34,39.05
  Bottom 0.152: v33.97,31.91 33.66,32.23 33.66,38.74 v33.34,39.05
SW_X_MODE  (via drill 0.3)
  Top 0.152: JP82.1 44.29,67.47 44.29,56.83 v36.51,49.05 | IC2.2 28.97,47.07 30.64,48.74 34.45,48.74 v35.08,48.1
  Bottom 0.152: v35.08,48.1 35.56,48.1 v36.51,49.05
SW_X_RANGE  (via drill 0.3)
  Top 0.152: JP83.1 40.01,20 38.1,20 37.47,20.64 37.47,24.61 34.92,27.15 34.92,32.86 v34.61,33.18 | IC2.58 31.75,41.12 v34.13,41.12
  Bottom 0.152: v34.61,33.18 34.29,33.5 34.29,40.96 v34.13,41.12
SWCLK  (via drill 0.3)
  Top 0.152: IC2.49 33.44,36.57 35.56,34.45 35.56,30.16 36.2,29.53 v41.12,29.53 | JP1.3 44.13,38.74 44.13,35.08 43.66,34.61 43.66,30 v44.13,29.53 | JP4.4 49.69,29.53 49.69,28.42 49.21,27.94 45.56,27.94 v44.93,27.3
  Bottom 0.152: v41.12,29.53 v44.13,29.53 44.13,28.1 v44.93,27.3
SWDIO  (via drill 0.3)
  Top 0.152: JP1.2 46.2,40.32 44.45,38.58 44.45,34.93 43.97,34.45 43.97,30.8 44.93,29.85 44.93,28.26 | IC2.46 28.47,32.91 28.1,32.54 28.1,27.78 31.59,24.29 v35.4,24.29 | JP4.2 48.1,28.26 44.93,28.26 | 44.93,28.26 44.29,27.62 44.29,25.4 v44.93,24.77
  Bottom 0.152: v35.4,24.29 35.72,23.97 44.13,23.97 v44.93,24.77
T_CLOCK
  Top 0.152: JP64.1 10.48,14.92 12.38,14.92 14.45,16.99 14.45,23.97 18.57,28.1 19.84,28.1 23.34,31.59 25.08,31.59 26.04,32.54 26.04,33.18 25.4,33.81 25.4,34.37 IC2.40 25.56,34.35
TX  (via drill 0.3)
  Top 0.152: IC2.42 26.47,42.82 v27.3,43.66 | R2.2 46.46,59.63 v46.51,59.69
  Bottom 0.152: v27.3,43.66 28.26,44.61 43.81,44.61 45.09,45.88 45.09,53.98 44.13,54.93 44.13,56.2 45.56,57.63 45.56,58.74 v46.51,59.69
VCC  (via drill 0.3)
  Top 0.305: F1.1 21.17,57.37 20.48,56.67 17.14,56.67 14.13,59.69 C2.+ 14.13,62.71 11.59,65.25 v2.38,65.25 | v12.86,30.8 v15.4,30.8
  Bottom 0.305: v2.38,65.25 0.79,63.66 0.79,34.13 JP3.1 10.32,33.34 v12.86,30.8 | v15.4,30.8 15.4,29.85 17.14,28.1 26.04,28.1 32.86,21.27 JP38.1
VEE  (via drill 0.3)
  Top 0.305: R68.1 3.65,51.75 v4.76,50.64 | F2.1 v35.56,63.18 | v41.59,62.39 39.75,62.39 C11.-
  Top 0.406: F2.1 38.54,61.18 C11.-
  Bottom 0.305: v4.76,50.64 3.65,50.64 1.43,52.86 1.43,62.87 3.17,64.61 34.13,64.61 v35.56,63.18 | JP39.1 21.43,11.91 41.43,11.91 42.7,10.64 42.7,7.94 44.45,6.19 46.51,6.19 47.62,7.3 47.62,23.02 46.04,24.61 46.04,34.77 47.62,36.35 49.37,36.35 49.69,36.67 49.69,60.96 48.26,62.39 v41.59,62.39
VREF  (via drill 0.3)
  Top 0.152: JP100.1 13.65,20.64 13.65,24.45 18.41,29.21 v19.21,29.21 | v23.5,29.21 23.97,29.69 25.72,29.69 32.23,23.18 v35.4,23.18 | v42.39,38.42 40.16,40.64 C25.1
  Top 0.305: IC4.3 39.38,40.44 C25.1
  Bottom 0.152: v19.21,29.21 v23.5,29.21 | v35.4,23.18 35.88,23.65 44.77,23.65 45.56,24.45 45.56,35.24 v42.39,38.42
X_CLOCK  (via drill 0.3)
  Top 0.152: IC2.41 25.97,33.72 v26.67,33.02 | v36.83,14.13 36.51,14.45 36.51,24.13 35.72,24.92 35.08,24.92 34.77,24.61 31.75,24.61 28.89,27.46 v28.89,28.26
  Bottom 0.152: v26.67,33.02 26.67,30.48 v28.89,28.26 | v36.83,14.13 37.62,14.92 40.01,14.92 JP65.1

### Text on the board
bPlace: CC-BY-SA OLIVIER GILLET / / BASED ON THE / MUTABLE INSTRUMENTS / MARBLES BY OLIVIER GILLET / / REDESIGN BY / DAVID SZEBENYI | TX | ANTUMBRA | RX | RES | CLK | IO | GND | ON | JACK / LIGHTS | OFF | V1.2 | CARA
tStop: Marbles | cc-by-sa Olivier Gillet | 2017. v7